# EAGLE design tester (EAGLE 9.6.2)

## Sheet 1 of 4: BUS
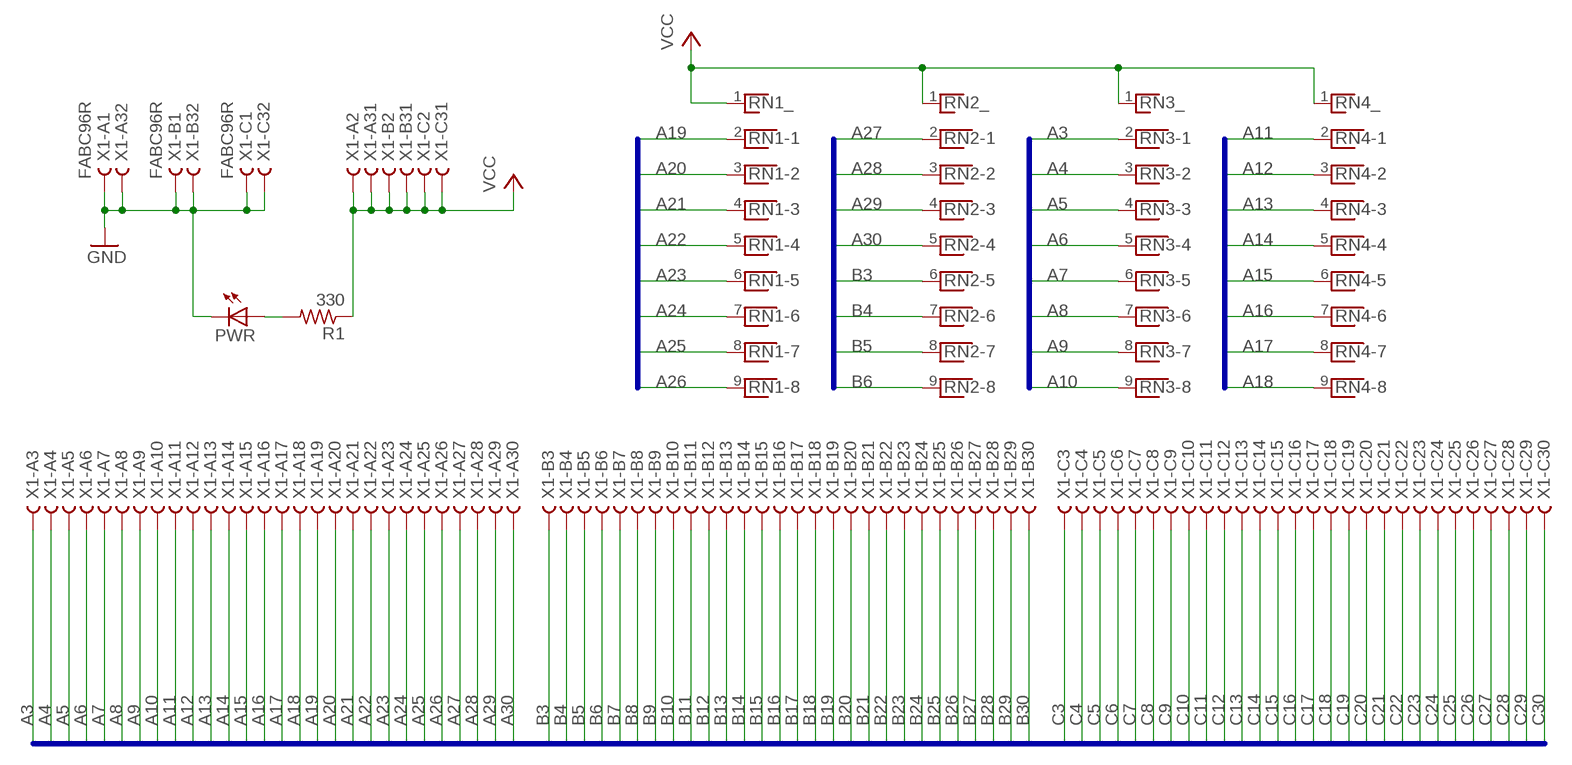
[diagram p0: schematic, sheet 1]

### Parts
PWR  LED5MM  [LED5MM]
R1  330  R-US_0207/10  [0207/10]
RN1  RNX8  [RN-9]
RN2  RNX8  [RN-9]
RN3  RNX8  [RN-9]
RN4  RNX8  [RN-9]
X1  FABC96R  [FABC96R]

### Nets
A3: RN3.2 X1.A3 ; also sheet 2
A4: RN3.3 X1.A4 ; also sheet 2
A5: RN3.4 X1.A5 ; also sheet 2
A6: RN3.5 X1.A6 ; also sheet 2
A7: RN3.6 X1.A7 ; also sheet 2
A8: RN3.7 X1.A8 ; also sheet 2
A9: RN3.8 X1.A9 ; also sheet 2
A10: RN3.9 X1.A10 ; also sheet 2
A11: RN4.2 X1.A11 ; also sheet 2
A12: RN4.3 X1.A12 ; also sheet 2
A13: RN4.4 X1.A13 ; also sheet 2
A14: RN4.5 X1.A14 ; also sheet 2
A15: RN4.6 X1.A15 ; also sheet 2
A16: RN4.7 X1.A16 ; also sheet 2
A17: RN4.8 X1.A17 ; also sheet 2
A18: RN4.9 X1.A18 ; also sheet 2
A19: RN1.2 X1.A19 ; also sheet 2
A20: RN1.3 X1.A20 ; also sheet 2
A21: RN1.4 X1.A21 ; also sheet 2
A22: RN1.5 X1.A22 ; also sheet 2
A23: RN1.6 X1.A23 ; also sheet 2
A24: RN1.7 X1.A24 ; also sheet 2
A25: RN1.8 X1.A25 ; also sheet 2
A26: RN1.9 X1.A26 ; also sheet 2
A27: RN2.2 X1.A27 ; also sheet 2
A28: RN2.3 X1.A28 ; also sheet 2
A29: RN2.4 X1.A29 ; also sheet 2
A30: RN2.5 X1.A30 ; also sheet 2
B3: RN2.6 X1.B3 ; also sheet 2
B4: RN2.7 X1.B4 ; also sheet 2
B5: RN2.8 X1.B5 ; also sheet 2
B6: RN2.9 X1.B6 ; also sheet 2
B7: X1.B7 ; also sheet 2
B8: X1.B8 ; also sheet 2
B9: X1.B9 ; also sheet 2
B10: X1.B10 ; also sheet 2
B11: X1.B11 ; also sheet 2
B12: X1.B12 ; also sheet 2
B13: X1.B13 ; also sheet 2
B14: X1.B14 ; also sheet 2
B15: X1.B15 ; also sheet 2
B16: X1.B16 ; also sheet 2
B17: X1.B17 ; also sheet 2
B18: X1.B18 ; also sheet 2
B19: X1.B19 ; also sheet 2
B20: X1.B20 ; also sheet 2
B21: X1.B21 ; also sheet 2
B22: X1.B22 ; also sheet 2
B23: X1.B23 ; also sheet 2
B24: X1.B24 ; also sheet 2
B25: X1.B25 ; also sheet 2
B26: X1.B26 ; also sheet 2
B27: X1.B27 ; also sheet 2
B28: X1.B28 ; also sheet 2
B29: X1.B29 ; also sheet 2
B30: X1.B30 ; also sheet 2
C3: X1.C3 ; also sheet 2
C4: X1.C4 ; also sheet 2
C5: X1.C5 ; also sheet 2
C6: X1.C6 ; also sheet 2
C7: X1.C7 ; also sheet 2
C8: X1.C8 ; also sheet 2
C9: X1.C9 ; also sheet 2
C10: X1.C10 ; also sheet 2
C11: X1.C11 ; also sheet 2
C12: X1.C12 ; also sheet 2
C13: X1.C13 ; also sheet 2
C14: X1.C14 ; also sheet 2
C15: X1.C15 ; also sheet 2
C16: X1.C16 ; also sheet 2
C17: X1.C17 ; also sheet 2
C18: X1.C18 ; also sheet 2
C19: X1.C19 ; also sheet 2
C20: X1.C20 ; also sheet 2
C21: X1.C21 ; also sheet 2
C22: X1.C22 ; also sheet 2
C23: X1.C23 ; also sheet 2
C24: X1.C24 ; also sheet 2
C25: X1.C25 ; also sheet 2
C26: X1.C26 ; also sheet 2
C27: X1.C27 ; also sheet 2
C28: X1.C28 ; also sheet 2
C29: X1.C29 ; also sheet 2
C30: X1.C30 ; also sheet 2
GND: PWR.K(C) X1.A1 X1.A32 X1.B1 X1.B32 X1.C1 X1.C32 ; also sheet 2,3,4
N$5: PWR.A R1.2
VCC: R1.1 RN1.1 RN2.1 RN3.1 RN4.1 X1.A2 X1.A31 X1.B2 X1.B31 X1.C2 X1.C31 ; also sheet 2,3,4

### Buses
ADDR[0..15],DATA[0..15],CNTL[0..48]
ADDR[0..15],DATA[0..15],REG-FUNC,REG-BRD-RD-ID,REG-RD-ID[0..2],REG-BRD-LD-ID,REG-LD-ID[0..2],REG-RD-LO,REG-LD-LO,REG-RD-HI,REG-LD-HI,MEM-WR,MEM-RD,I/O-WR,I/O-RD,I/O-ADDR,INT,INTA,I/D-REG-LD,I/D-REG-RD,I/D-REG-DN,I/D-REG-UP,SP/PC-SEL,SP/PC-DATA-RD-LO,SP/PC-DATA-RD-HI,SP/PC-ADDR-RD,SP/PC-LD-LO,SP/PC-LD-HI,SP/PC-DN,SP/PC-UP,ALU-FUNC,ALU[0..3],AC-LD-INV,AC-LD,AC-RD,SR-LD,BR-COND,H/L-SWAP,IN,OUT,UNUSED[1..5],RUN,RESET

## Sheet 2 of 4: bus cntl
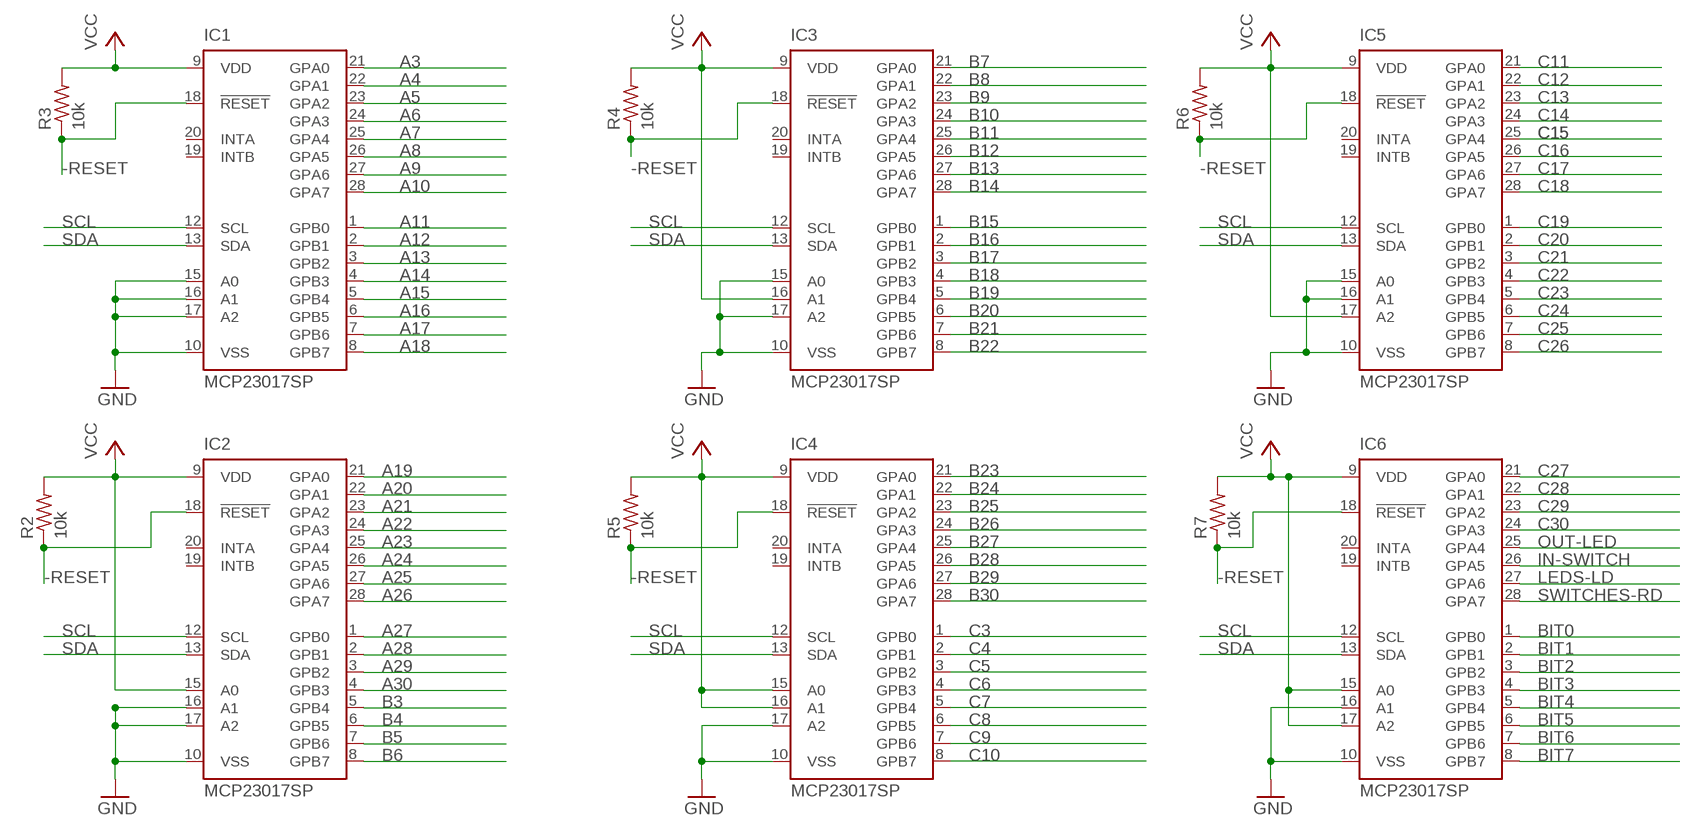
[diagram p1: schematic, sheet 2]

### Parts
IC1  MCP23017SP  [DIL28-3]
IC2  MCP23017SP  [DIL28-3]
IC3  MCP23017SP  [DIL28-3]
IC4  MCP23017SP  [DIL28-3]
IC5  MCP23017SP  [DIL28-3]
IC6  MCP23017SP  [DIL28-3]
R2  10k  R-US_0207/10  [0207/10]
R3  10k  R-US_0207/10  [0207/10]
R4  10k  R-US_0207/10  [0207/10]
R5  10k  R-US_0207/10  [0207/10]
R6  10k  R-US_0207/10  [0207/10]
R7  10k  R-US_0207/10  [0207/10]

### Nets
-RESET: IC1.18(!RESET) IC2.18(!RESET) IC3.18(!RESET) IC4.18(!RESET) IC5.18(!RESET) IC6.18(!RESET) R2.1 R3.1 R4.1 R5.1 R6.1 R7.1 ; also sheet 3
A3: IC1.21(GPA0) ; also sheet 1
A4: IC1.22(GPA1) ; also sheet 1
A5: IC1.23(GPA2) ; also sheet 1
A6: IC1.24(GPA3) ; also sheet 1
A7: IC1.25(GPA4) ; also sheet 1
A8: IC1.26(GPA5) ; also sheet 1
A9: IC1.27(GPA6) ; also sheet 1
A10: IC1.28(GPA7) ; also sheet 1
A11: IC1.1(GPB0) ; also sheet 1
A12: IC1.2(GPB1) ; also sheet 1
A13: IC1.3(GPB2) ; also sheet 1
A14: IC1.4(GPB3) ; also sheet 1
A15: IC1.5(GPB4) ; also sheet 1
A16: IC1.6(GPB5) ; also sheet 1
A17: IC1.7(GPB6) ; also sheet 1
A18: IC1.8(GPB7) ; also sheet 1
A19: IC2.21(GPA0) ; also sheet 1
A20: IC2.22(GPA1) ; also sheet 1
A21: IC2.23(GPA2) ; also sheet 1
A22: IC2.24(GPA3) ; also sheet 1
A23: IC2.25(GPA4) ; also sheet 1
A24: IC2.26(GPA5) ; also sheet 1
A25: IC2.27(GPA6) ; also sheet 1
A26: IC2.28(GPA7) ; also sheet 1
A27: IC2.1(GPB0) ; also sheet 1
A28: IC2.2(GPB1) ; also sheet 1
A29: IC2.3(GPB2) ; also sheet 1
A30: IC2.4(GPB3) ; also sheet 1
B3: IC2.5(GPB4) ; also sheet 1
B4: IC2.6(GPB5) ; also sheet 1
B5: IC2.7(GPB6) ; also sheet 1
B6: IC2.8(GPB7) ; also sheet 1
B7: IC3.21(GPA0) ; also sheet 1
B8: IC3.22(GPA1) ; also sheet 1
B9: IC3.23(GPA2) ; also sheet 1
B10: IC3.24(GPA3) ; also sheet 1
B11: IC3.25(GPA4) ; also sheet 1
B12: IC3.26(GPA5) ; also sheet 1
B13: IC3.27(GPA6) ; also sheet 1
B14: IC3.28(GPA7) ; also sheet 1
B15: IC3.1(GPB0) ; also sheet 1
B16: IC3.2(GPB1) ; also sheet 1
B17: IC3.3(GPB2) ; also sheet 1
B18: IC3.4(GPB3) ; also sheet 1
B19: IC3.5(GPB4) ; also sheet 1
B20: IC3.6(GPB5) ; also sheet 1
B21: IC3.7(GPB6) ; also sheet 1
B22: IC3.8(GPB7) ; also sheet 1
B23: IC4.21(GPA0) ; also sheet 1
B24: IC4.22(GPA1) ; also sheet 1
B25: IC4.23(GPA2) ; also sheet 1
B26: IC4.24(GPA3) ; also sheet 1
B27: IC4.25(GPA4) ; also sheet 1
B28: IC4.26(GPA5) ; also sheet 1
B29: IC4.27(GPA6) ; also sheet 1
B30: IC4.28(GPA7) ; also sheet 1
BIT0: IC6.1(GPB0) ; also sheet 4
BIT1: IC6.2(GPB1) ; also sheet 4
BIT2: IC6.3(GPB2) ; also sheet 4
BIT3: IC6.4(GPB3) ; also sheet 4
BIT4: IC6.5(GPB4) ; also sheet 4
BIT5: IC6.6(GPB5) ; also sheet 4
BIT6: IC6.7(GPB6) ; also sheet 4
BIT7: IC6.8(GPB7) ; also sheet 4
C3: IC4.1(GPB0) ; also sheet 1
C4: IC4.2(GPB1) ; also sheet 1
C5: IC4.3(GPB2) ; also sheet 1
C6: IC4.4(GPB3) ; also sheet 1
C7: IC4.5(GPB4) ; also sheet 1
C8: IC4.6(GPB5) ; also sheet 1
C9: IC4.7(GPB6) ; also sheet 1
C10: IC4.8(GPB7) ; also sheet 1
C11: IC5.21(GPA0) ; also sheet 1
C12: IC5.22(GPA1) ; also sheet 1
C13: IC5.23(GPA2) ; also sheet 1
C14: IC5.24(GPA3) ; also sheet 1
C15: IC5.25(GPA4) ; also sheet 1
C16: IC5.26(GPA5) ; also sheet 1
C17: IC5.27(GPA6) ; also sheet 1
C18: IC5.28(GPA7) ; also sheet 1
C19: IC5.1(GPB0) ; also sheet 1
C20: IC5.2(GPB1) ; also sheet 1
C21: IC5.3(GPB2) ; also sheet 1
C22: IC5.4(GPB3) ; also sheet 1
C23: IC5.5(GPB4) ; also sheet 1
C24: IC5.6(GPB5) ; also sheet 1
C25: IC5.7(GPB6) ; also sheet 1
C26: IC5.8(GPB7) ; also sheet 1
C27: IC6.21(GPA0) ; also sheet 1
C28: IC6.22(GPA1) ; also sheet 1
C29: IC6.23(GPA2) ; also sheet 1
C30: IC6.24(GPA3) ; also sheet 1
GND: IC1.10(VSS) IC1.15(A0) IC1.16(A1) IC1.17(A2) IC2.10(VSS) IC2.16(A1) IC2.17(A2) IC3.10(VSS) IC3.15(A0) IC3.17(A2) IC4.10(VSS) IC4.17(A2) IC5.10(VSS) IC5.15(A0) IC5.16(A1) IC6.10(VSS) IC6.16(A1) ; also sheet 1,3,4
IN-SWITCH: IC6.26(GPA5) ; also sheet 4
LEDS-LD: IC6.27(GPA6) ; also sheet 4
OUT-LED: IC6.25(GPA4) ; also sheet 4
SCL: IC1.12(SCL) IC2.12(SCL) IC3.12(SCL) IC4.12(SCL) IC5.12(SCL) IC6.12(SCL) ; also sheet 3
SDA: IC1.13(SDA) IC2.13(SDA) IC3.13(SDA) IC4.13(SDA) IC5.13(SDA) IC6.13(SDA) ; also sheet 3
SWITCHES-RD: IC6.28(GPA7) ; also sheet 4
VCC: IC1.9(VDD) IC2.9(VDD) IC2.15(A0) IC3.9(VDD) IC3.16(A1) IC4.9(VDD) IC4.15(A0) IC4.16(A1) IC5.9(VDD) IC5.17(A2) IC6.9(VDD) IC6.15(A0) IC6.17(A2) R2.2 R3.2 R4.2 R5.2 R6.2 R7.2 ; also sheet 1,3,4
Unconnected: IC1.19(INTB) IC1.20(INTA) IC2.19(INTB) IC2.20(INTA) IC3.19(INTB) IC3.20(INTA) IC4.19(INTB) IC4.20(INTA) IC5.19(INTB) IC5.20(INTA) IC6.19(INTB) IC6.20(INTA)

## Sheet 3 of 4: CPU
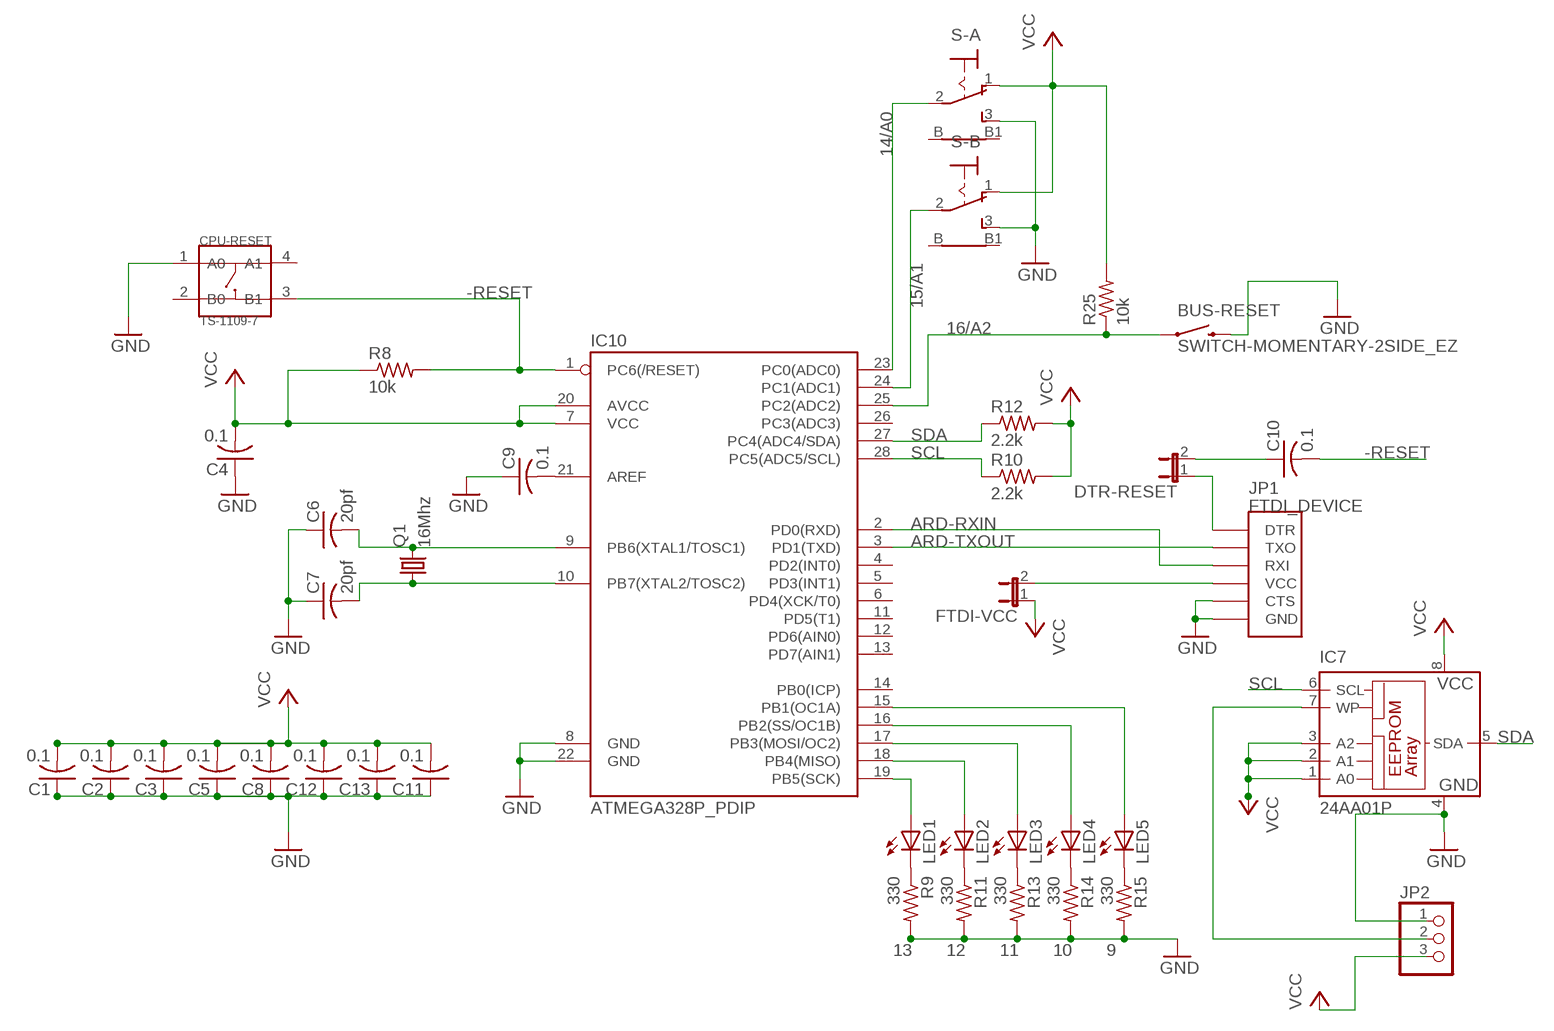
[diagram p2: schematic, sheet 3]

### Parts
BUS-RESET  SWITCH-MOMENTARY-2SIDE_EZ  [TACTILE-PTH-SIDEEZ]
C1  0.1  C-US025-024X044  [C025-024X044]
C2  0.1  C-US025-024X044  [C025-024X044]
C3  0.1  C-US025-024X044  [C025-024X044]
C4  0.1  C-US025-024X044  [C025-024X044]
C5  0.1  C-US025-024X044  [C025-024X044]
C6  20pf  C-US025-024X044  [C025-024X044]
C7  20pf  C-US025-024X044  [C025-024X044]
C8  0.1  C-US025-024X044  [C025-024X044]
C9  0.1  C-US025-024X044  [C025-024X044]
C10  0.1  C-US025-024X044  [C025-024X044]
C11  0.1  C-US025-024X044  [C025-024X044]
C12  0.1  C-US025-024X044  [C025-024X044]
C13  0.1  C-US025-024X044  [C025-024X044]
CPU-RESET  TS-1109-7  DIP-BUTTON-TOP-BLACK(4P-D6.2MM)  [SW4-6.2X6.2X5.0MM]
DTR-RESET  JP1E  [JP1]
FTDI-VCC  JP1E  [JP1]
IC7  24AA01P  [DIL8]
IC10  ATMEGA328P_PDIP  [DIL28-3]
JP1  FTDI_DEVICE  [FTDI_DEVICE_SIDE]
JP2  PINHD-1X3  [1X03]
LED1  LED5MM  [LED5MM]
LED2  LED5MM  [LED5MM]
LED3  LED5MM  [LED5MM]
LED4  LED5MM  [LED5MM]
LED5  LED5MM  [LED5MM]
Q1  16Mhz  CRYSTALHC49S  [HC49/S]
R8  10k  R-US_0207/10  [0207/10]
R9  330  R-US_0207/10  [0207/10]
R10  2.2k  R-US_0207/10  [0207/10]
R11  330  R-US_0207/10  [0207/10]
R12  2.2k  R-US_0207/10  [0207/10]
R13  330  R-US_0207/10  [0207/10]
R14  330  R-US_0207/10  [0207/10]
R15  330  R-US_0207/10  [0207/10]
R25  10k  R-US_0207/10  [0207/10]
S-A  9070-1W  [9070-1W]
S-B  9070-1W  [9070-1W]

### Nets
-RESET: C10.2 CPU-RESET.3(B1) IC10.1(PC6(/RESET)) R8.2 ; also sheet 2
ARD-RXIN: IC10.2(PD0(RXD)) JP1.P$3(RXI)
ARD-TXOUT: IC10.3(PD1(TXD)) JP1.P$2(TXO)
GND: BUS-RESET.2 C1.1 C2.1 C3.1 C4.1 C5.1 C6.1 C7.1 C8.1 C9.1 C11.1 C12.1 C13.1 CPU-RESET.1(A0) IC7.4(GND) IC10.8(GND) IC10.22(GND) JP1.P$5(CTS) JP1.P$6(GND) JP2.1 R9.2 R11.2 R13.2 R14.2 R15.2 S-A.3(S) S-B.3(S) ; also sheet 1,2,4
N$1: IC10.19(PB5(SCK)) LED1.A
N$2: IC7.7(WP) JP2.2
N$3: C6.2 IC10.9(PB6(XTAL1/TOSC1)) Q1.2
N$4: C7.2 IC10.10(PB7(XTAL2/TOSC2)) Q1.1
N$6: IC10.18(PB4(MISO)) LED2.A
N$7: IC10.17(PB3(MOSI/OC2)) LED3.A
N$8: IC10.16(PB2(SS/OC1B)) LED4.A
N$9: C10.1 DTR-RESET.2
N$10: IC10.15(PB1(OC1A)) LED5.A
N$11: LED2.K(C) R11.1
N$12: LED1.K(C) R9.1
N$13: LED3.K(C) R13.1
N$14: C9.2 IC10.21(AREF)
N$15: LED4.K(C) R14.1
N$16: LED5.K(C) R15.1
N$18: IC10.23(PC0(ADC0)) S-A.2(P)
N$19: IC10.24(PC1(ADC1)) S-B.2(P)
N$28: DTR-RESET.1 JP1.P$1(DTR)
N$29: FTDI-VCC.2 JP1.P$4(VCC)
N$39: BUS-RESET.1 IC10.25(PC2(ADC2)) R25.1
SCL: IC7.6(SCL) IC10.28(PC5(ADC5/SCL)) R10.1 ; also sheet 2
SDA: IC7.5(SDA) IC10.27(PC4(ADC4/SDA)) R12.1 ; also sheet 2
VCC: C1.2 C2.2 C3.2 C4.2 C5.2 C8.2 C11.2 C12.2 C13.2 FTDI-VCC.1 IC7.1(A0) IC7.2(A1) IC7.3(A2) IC7.8(VCC) IC10.7(VCC) IC10.20(AVCC) JP2.3 R8.1 R10.2 R12.2 R25.2 S-A.1(O) S-B.1(O) ; also sheet 1,2,4
Unconnected: CPU-RESET.2(B0) CPU-RESET.4(A1) IC10.4(PD2(INT0)) IC10.5(PD3(INT1)) IC10.6(PD4(XCK/T0)) IC10.11(PD5(T1)) IC10.12(PD6(AIN0)) IC10.13(PD7(AIN1)) IC10.14(PB0(ICP)) IC10.26(PC3(ADC3)) S-A.B S-A.B1 S-B.B S-B.B1

### Notes on the sheet
- 14/A0
- 15/A1
- 16/A2
- 13 | 12 | 11 | 10 | 9

## Sheet 4 of 4: I/O
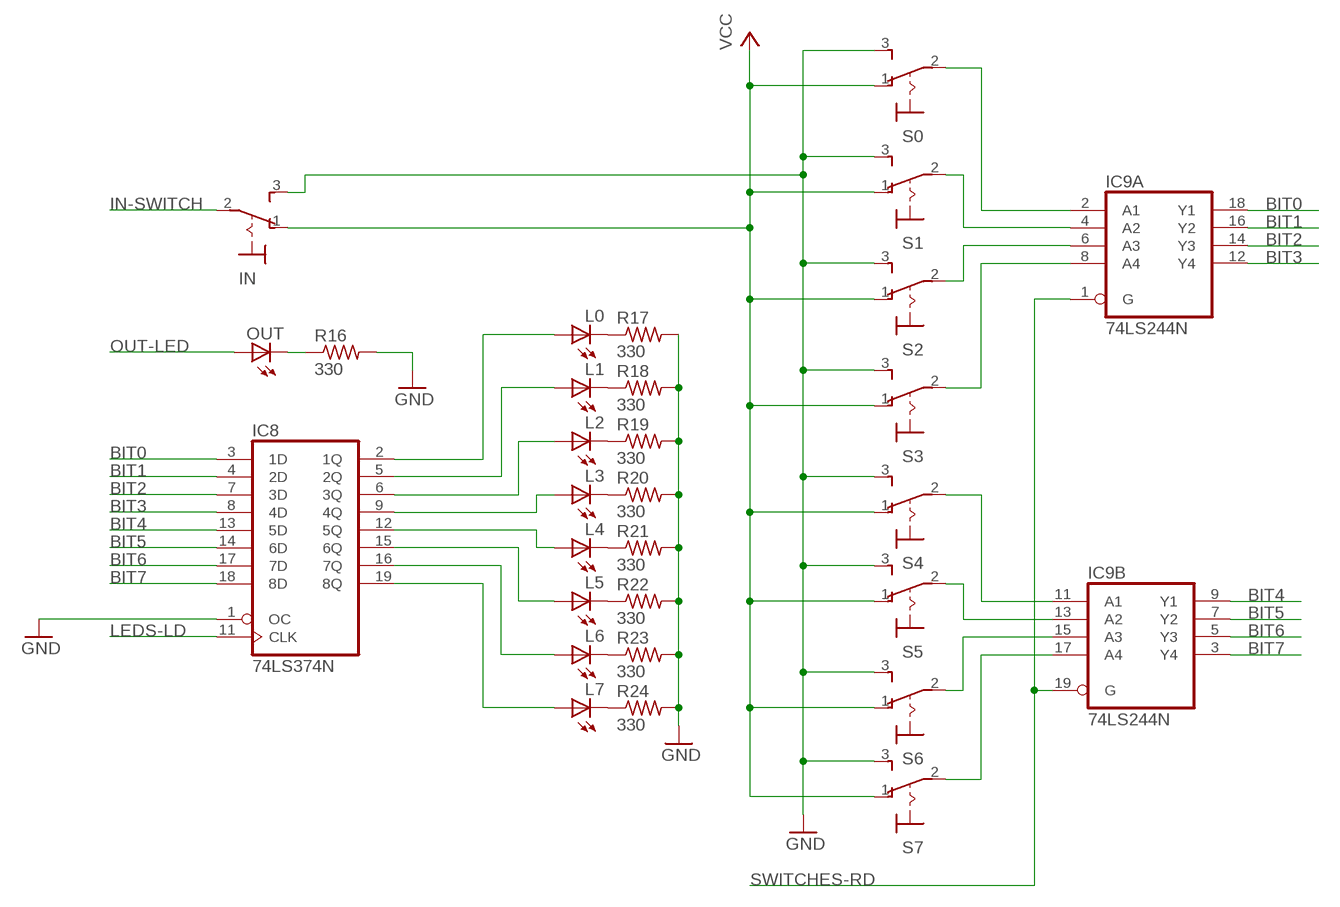
[diagram p3: schematic, sheet 4]

### Parts
IC8  74LS374N  [DIL20]
IC9  74LS244N  [DIL20]
IN  M9040P  [M9040P]
L0  LED5MM  [LED5MM]
L1  LED5MM  [LED5MM]
L2  LED5MM  [LED5MM]
L3  LED5MM  [LED5MM]
L4  LED5MM  [LED5MM]
L5  LED5MM  [LED5MM]
L6  LED5MM  [LED5MM]
L7  LED5MM  [LED5MM]
OUT  LED5MM  [LED5MM]
R16  330  R-US_0207/10  [0207/10]
R17  330  R-US_0207/10  [0207/10]
R18  330  R-US_0207/10  [0207/10]
R19  330  R-US_0207/10  [0207/10]
R20  330  R-US_0207/10  [0207/10]
R21  330  R-US_0207/10  [0207/10]
R22  330  R-US_0207/10  [0207/10]
R23  330  R-US_0207/10  [0207/10]
R24  330  R-US_0207/10  [0207/10]
S0  M9040P  [M9040P]
S1  M9040P  [M9040P]
S2  M9040P  [M9040P]
S3  M9040P  [M9040P]
S4  M9040P  [M9040P]
S5  M9040P  [M9040P]
S6  M9040P  [M9040P]
S7  M9040P  [M9040P]

### Nets
BIT0: IC8.3(1D) IC9.18(A:Y1) ; also sheet 2
BIT1: IC8.4(2D) IC9.16(A:Y2) ; also sheet 2
BIT2: IC8.7(3D) IC9.14(A:Y3) ; also sheet 2
BIT3: IC8.8(4D) IC9.12(A:Y4) ; also sheet 2
BIT4: IC8.13(5D) IC9.9(B:Y1) ; also sheet 2
BIT5: IC8.14(6D) IC9.7(B:Y2) ; also sheet 2
BIT6: IC8.17(7D) IC9.5(B:Y3) ; also sheet 2
BIT7: IC8.18(8D) IC9.3(B:Y4) ; also sheet 2
GND: IC8.1(OC) IN.3(S) R16.2 R17.2 R18.2 R19.2 R20.2 R21.2 R22.2 R23.2 R24.2 S0.3(S) S1.3(S) S2.3(S) S3.3(S) S4.3(S) S5.3(S) S6.3(S) S7.3(S) ; also sheet 1,2,3
IN-SWITCH: IN.2(P) ; also sheet 2
LEDS-LD: IC8.11(CLK) ; also sheet 2
N$17: L7.K(C) R24.1
N$20: L6.K(C) R23.1
N$21: L5.K(C) R22.1
N$22: L4.K(C) R21.1
N$23: L3.K(C) R20.1
N$24: L2.K(C) R19.1
N$25: L1.K(C) R18.1
N$26: L0.K(C) R17.1
N$27: OUT.K(C) R16.1
N$31: IC8.5(2Q) L1.A
N$32: IC8.9(4Q) L3.A
N$33: IC8.12(5Q) L4.A
N$34: IC8.15(6Q) L5.A
N$35: IC8.6(3Q) L2.A
N$36: IC8.16(7Q) L6.A
N$37: IC8.19(8Q) L7.A
N$38: IC8.2(1Q) L0.A
N$40: IC9.2(A:A1) S0.2(P)
N$41: IC9.8(A:A4) S3.2(P)
N$42: IC9.6(A:A3) S2.2(P)
N$43: IC9.4(A:A2) S1.2(P)
N$44: IC9.11(B:A1) S4.2(P)
N$45: IC9.17(B:A4) S7.2(P)
N$46: IC9.13(B:A2) S5.2(P)
N$47: IC9.15(B:A3) S6.2(P)
OUT-LED: OUT.A ; also sheet 2
SWITCHES-RD: IC9.1(A:G) IC9.19(B:G) ; also sheet 2
VCC: IN.1(O) S0.1(O) S1.1(O) S2.1(O) S3.1(O) S4.1(O) S5.1(O) S6.1(O) S7.1(O) ; also sheet 1,2,3

## Power pins joined to a net without a drawn wire
GND: IC8.10(GND) IC9.10(P:GND)
VCC: IC8.20(VCC) IC9.20(P:VCC)

## Library data of the parts
BUS-RESET = SparkFun-Electromechanical:SWITCH-MOMENTARY-2: Various NO switches- pushbuttons, reed, etc
C1-C13 = adafruit:C-US: CAPACITOR, American symbol
CPU-RESET = Seeed-OPL-Switch:DIP-BUTTON-TOP-BLACK(4P-D6.2MM): 311020032; MPN: TS-1109-7
DTR-RESET FTDI-VCC = jumper:JP1E: JUMPER
IC1-IC6 = microchip:MCP23017: http://ww1.microchip.com/downloads/en/DeviceDoc/21952a.pdf Source: http://ww1.microchip.com/downloads/en/DeviceDoc/21952a.pdf; MF: MICROCHIP; MPN: MCP23017-E/SP; OC_FARNELL: 1332088; OC_NEWARK: 31K2959
IC7 = microchip:24*: Serial EEPROM I2C; MPN: 24AA01-I/P; OC_FARNELL: 1331266; OC_NEWARK: 35M0692
IC8 = 74xx-us:74*374: Octal D type transparent LATCH, edge triggered
IC9 = 74xx-us:74*244: Octal BUFFER and LINE DRIVER, 3-state
IC10 = SparkFun-DigitalIC:ATMEGA328P_PDIP: uC used in the Arduino 32kb flash, 1k EEPROM, 2k SRAM This is the through-hole version of this chip.
IN S0 S1-S7 = switch:M9040P: TOGGLE SWITCH Marquardt
JP1 = SparkFun-Connectors:FTDI_DEVICE: Connector which mates to FTDI basic or FTDI cable.
JP2 = pinhead:PINHD-1X3: PIN HEADER
L0 L1-L7 LED1-LED5 OUT PWR = led:LED: LED OSRAM: - CHIPLED LG R971, LG N971, LY N971, LG Q971, LY Q971, LO R971, LY R971 LH N974, LH R974 LS Q976, LO Q976, LY Q976 LO Q996 - Hyper CHIPLED LW Q18S LB Q993, LB Q99A, LB R99A - SideLED LS A670, LO A670, LY A670, LG A670, LP A670 LB A673, LV A673, LT A673, LW A673 LH A674 LY A675 LS A676, LA A676, LO A676, LY A676, LW A676 LS A679, LY A679, LG A679 - Hyper Micro SIDELED® LS Y876, LA Y876, LO Y876, LY Y876 LT Y87S - SmartLED LW L88C, LW L88S LB L89C, LB L89S, LG L890 LS L89K, LO L89K, LY L89K LS L896, LA L896, LO L896, LY L896 - TOPLED LS T670, LO T670, LY T670, LG T670, LP T670 LSG T670, LSP T670, LSY T670, LOP T670, LYG T670 LG T671, LOG T671, LSG T671 LB T673, LV T673, LT T673, LW T673 LH T674 LS T676, LA T676, LO T676, LY T676, LB T676, LH T676, LSB T676, LW T676 LB T67C, LV T67C, LT T67C, LS T67K, LO T67K, LY T67K, LW E67C LS E67B, LA E67B, LO E67B, LY E67B, LB E67C, LV E67C, LT E67C LW T67C LS T679, LY T679, LG T679 LS T770, LO T770, LY T770, LG T770, LP T770 LB T773, LV T773, LT T773, LW T773 LH T774 LS E675, LA E675, LY E675, LS T675 LS T776, LA T776, LO T776, LY T776, LB T776 LHGB T686 LT T68C, LB T68C - Hyper Mini TOPLED® LB M676 - Mini TOPLED Santana® LG M470 LS M47K, LO M47K, LY M47K Source: http://www.osram.convergy.de LUXEON: - LUMILED® LXK2-PW12-R00, LXK2-PW12-S00, LXK2-PW14-U00, LXK2-PW14-V00 LXK2-PM12-R00, LXK2-PM12-S00, LXK2-PM14-U00 LXK2-PE12-Q00, LXK2-PE12-R00, LXK2-PE12-S00, LXK2-PE14-T00, LXK2-PE14-U00 LXK2-PB12-K00, LXK2-PB12-L00, LXK2-PB12-M00, LXK2-PB14-N00, LXK2-PB14-P00, LXK2-PB14-Q00 LXK2-PR12-L00, LXK2-PR12-M00, LXK2-PR14-Q00, LXK2-PR14-R00 LXK2-PD12-Q00, LXK2-PD12-R00, LXK2-PD12-S00 LXK2-PH12-R00, LXK2-PH12-S00 LXK2-PL12-P00, LXK2-PL12-Q00, LXK2-PL12-R00 Source: www.luxeon.com KINGBRIGHT: KA-3528ASYC Source: www.kingbright.com
Q1 = crystal:CRYSTAL: CRYSTAL; OC_FARNELL: 1667008; OC_NEWARK: unknown
R1-R7 = adafruit:R-US_: RESISTOR, American symbol
R8-R25 = resistor:R-US_: RESISTOR, American symbol
RN1-RN4 = resistor-net:RNX8: RESISTOR NETWORK; OC_FARNELL: unknown; OC_NEWARK: unknown
S-A S-B = switch:9070-1W: TOGGLE SWITCH Marquardt
X1 = con-vg:FABC96R: CONNECTOR female, 96 pins, type R, rows ABC, grid 2.54 mm

## Board
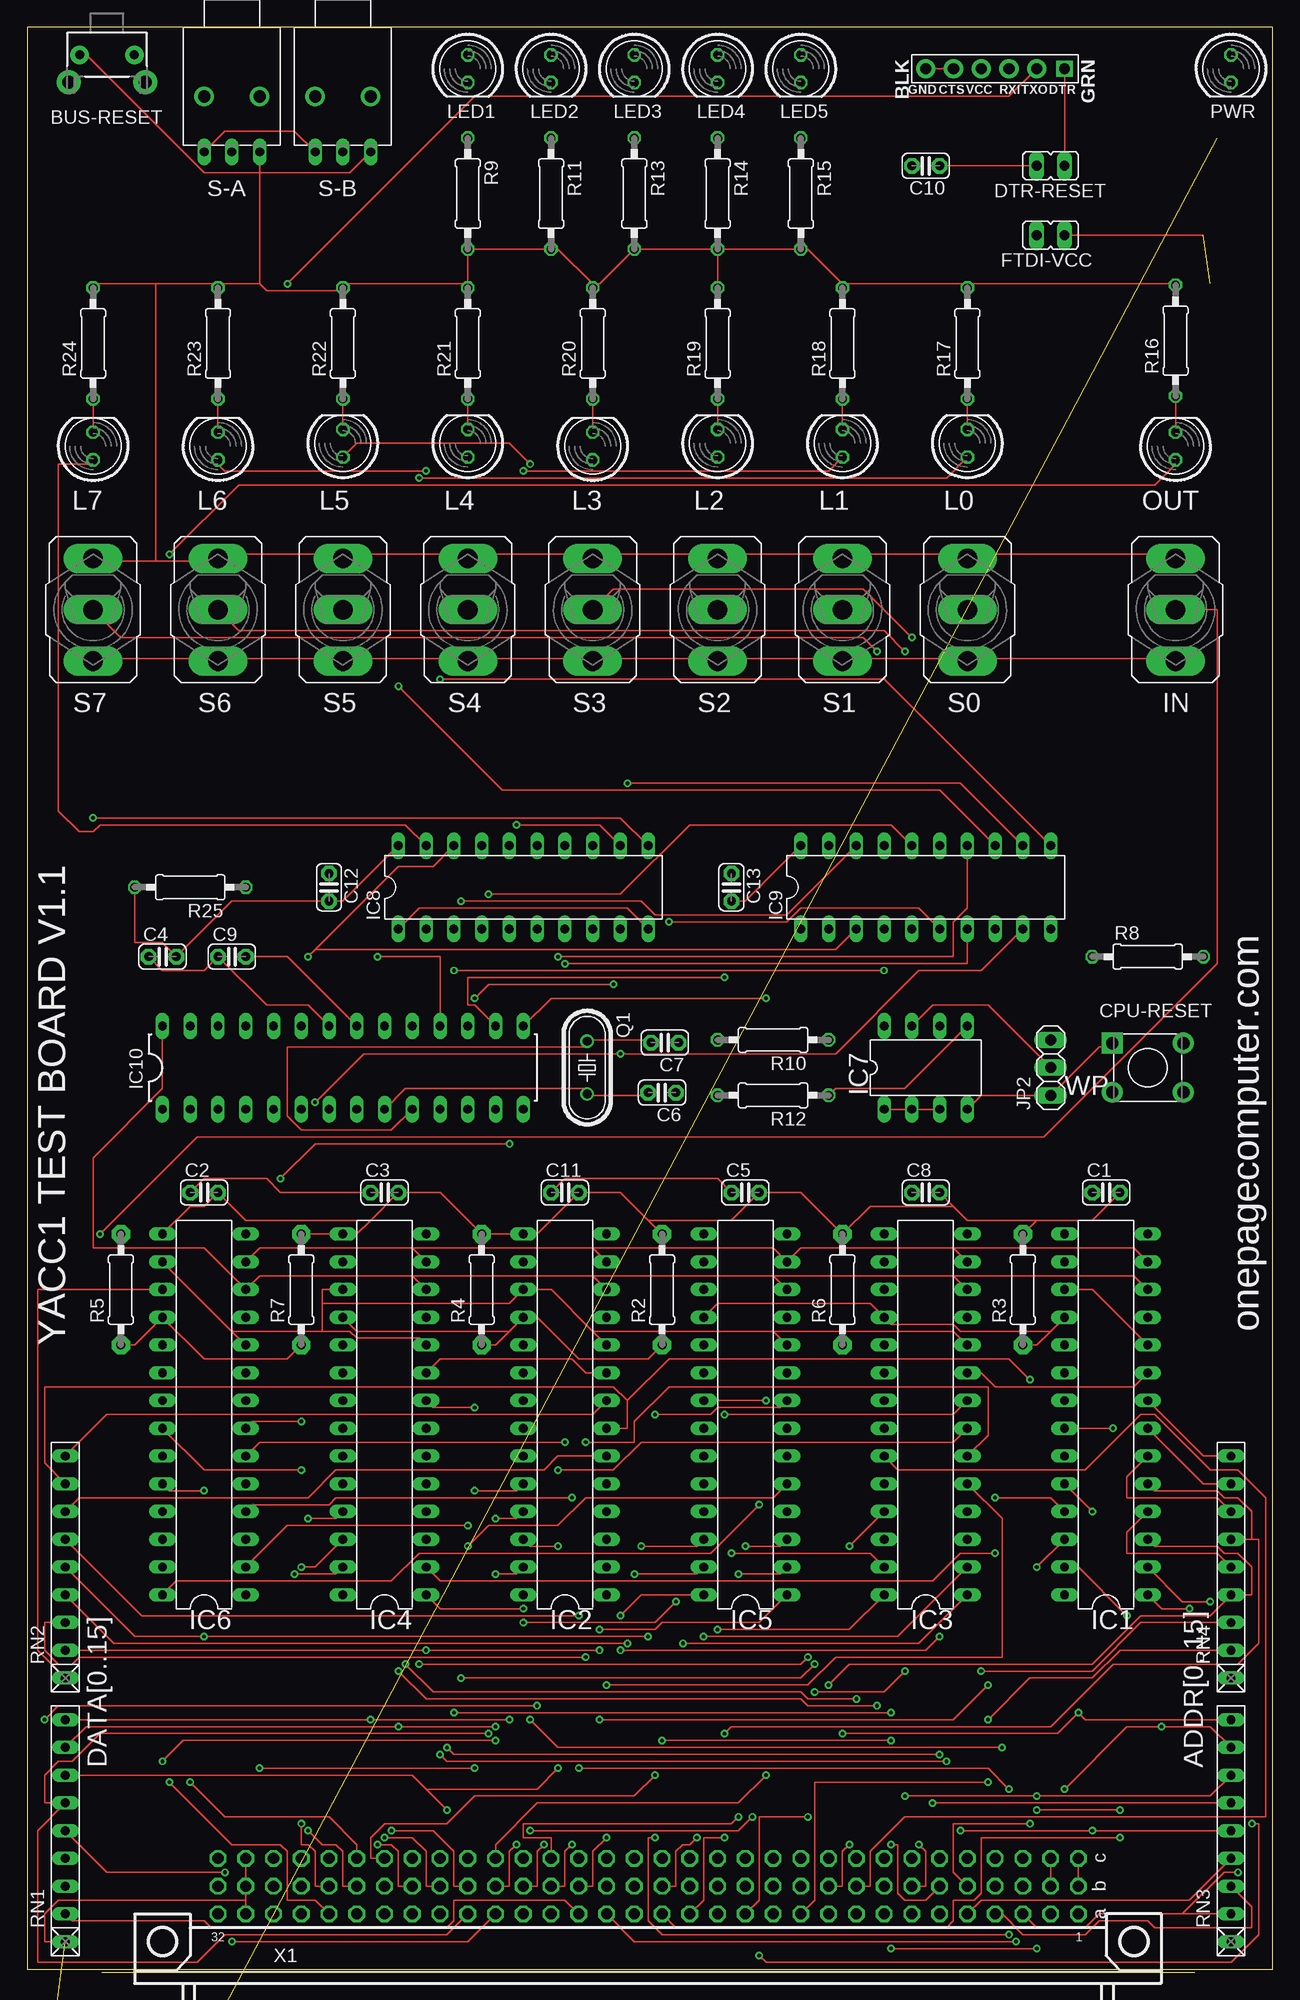
[diagram p4: board, top side]
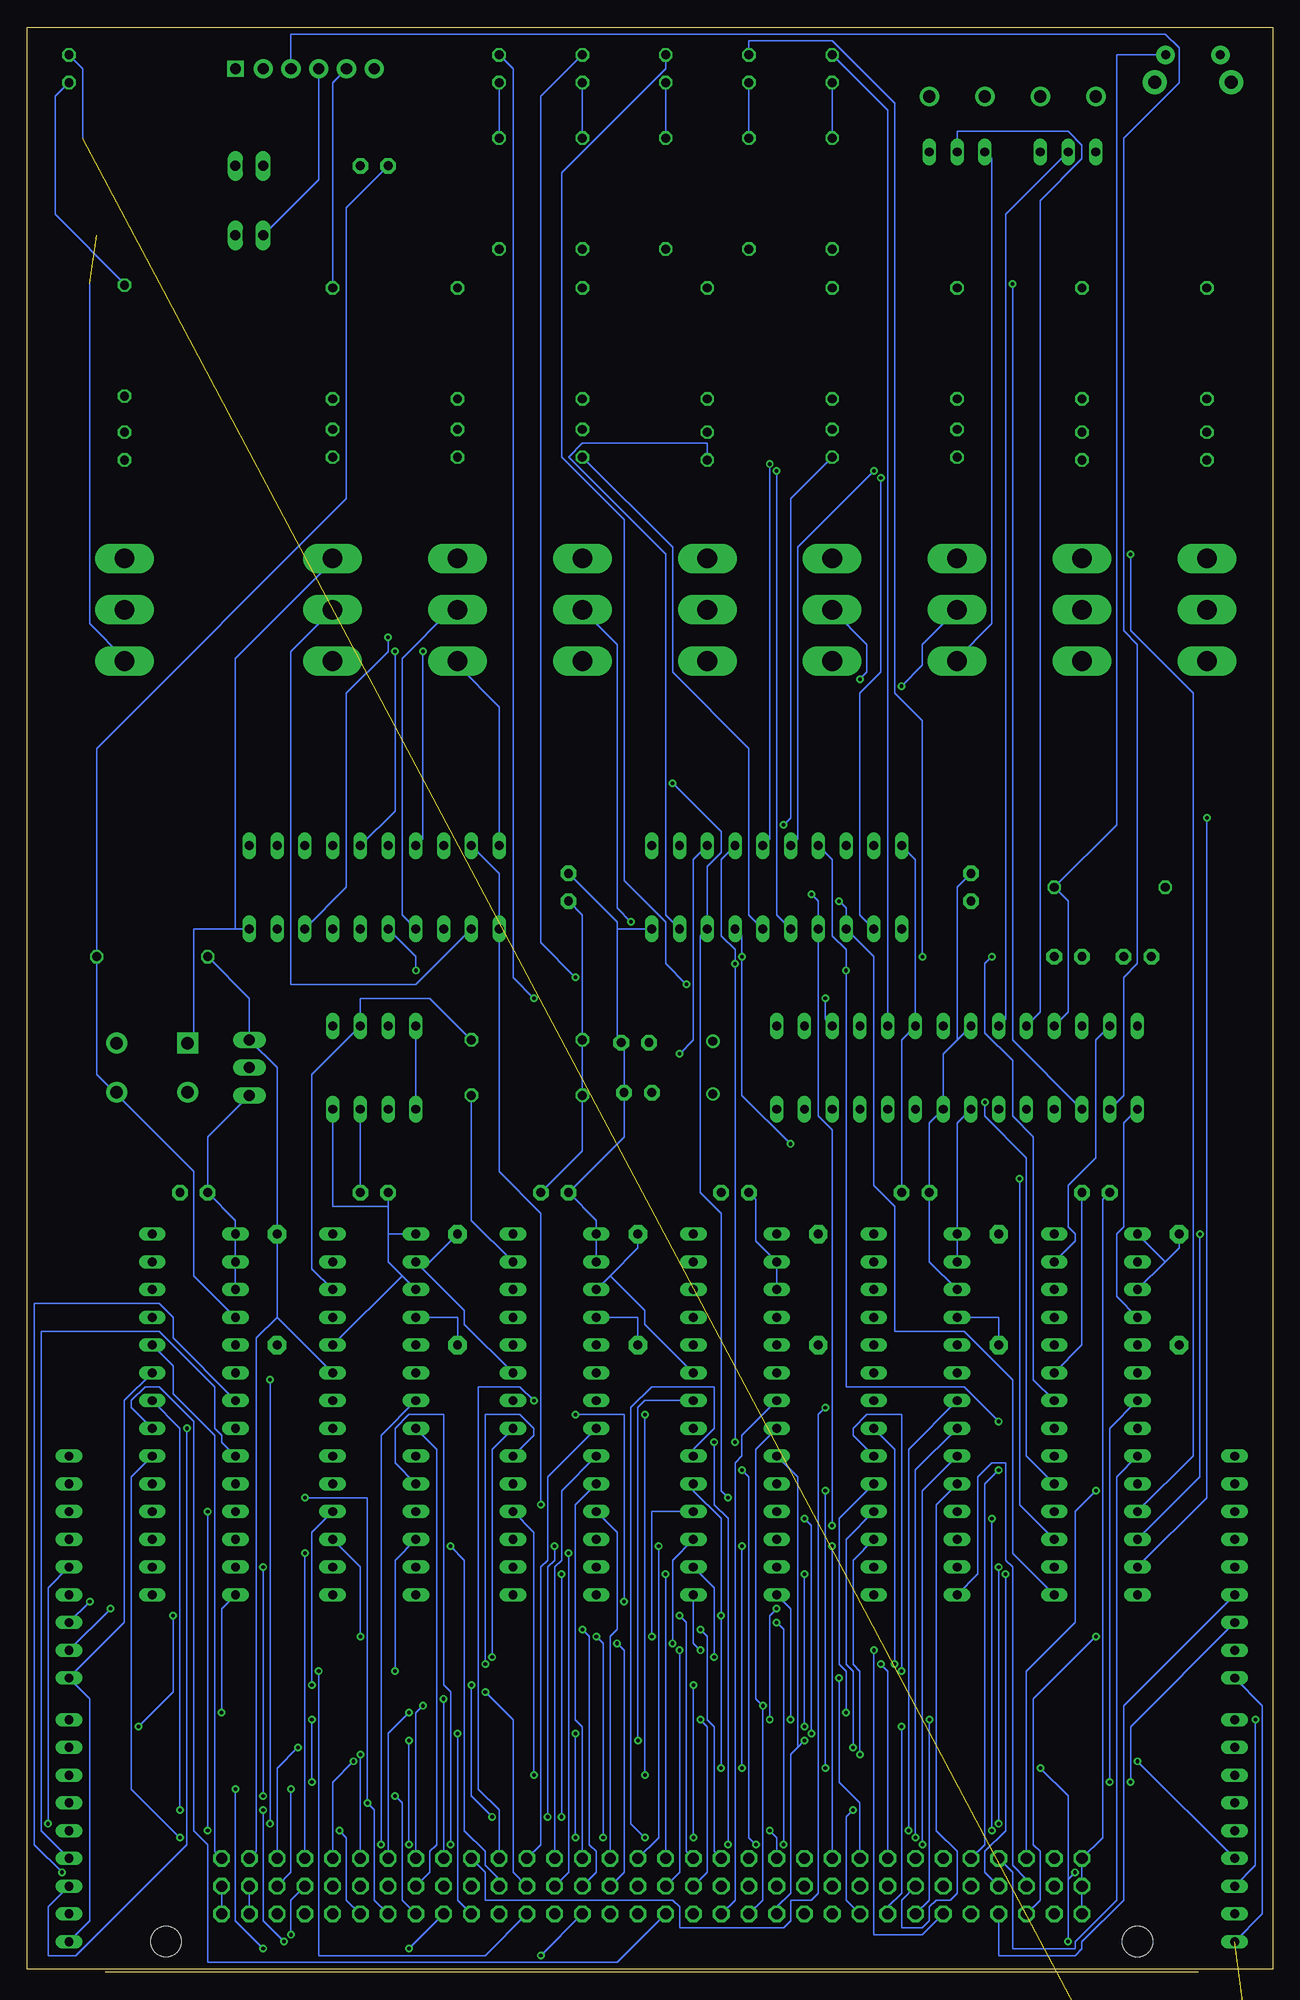
[diagram p5: board, bottom side, seen from below]

Size 113.97 x 177.78 mm. Coordinates in mm from the lower left corner, seen from the top.
Outline: 113.97,0 113.97,177.78 0,177.78 0,0 113.97,0
Copper layers (1*16): Top 0.0356mm / dielectric 1.5011mm / Bottom 0.0356mm
Design rules "LaenPCBOrder *": minimum track width 6mil, minimum drill 13mil, track to track 8mil, track to pad 8mil, pad to pad 8mil, via to via 8mil, smd to smd 6mil, copper to edge 15mil, drill to drill 6mil, minimum pad ring 7mil, minimum via ring 7mil, stop-mask expansion 3mil, vias tented up to drill 0mil, thermal gap 10mil

### Footprints (pad centres in the part's own frame; a part is rotated, then mirrored left to right if it is on the bottom)
TACTILE-PTH-SIDEEZ = drill 0.8 pad 1.7: 1 -2.5,0; 2 2.5,0 | drill 1.2 pad 2.2: ANCHOR1 -3.5,2.5; ANCHOR2 3.5,2.5
C025-024X044 = drill 0.813 pad 1.422 octagon: 1 -1.27,0; 2 1.27,0
SW4-6.2X6.2X5.0MM = drill 1.143 pad 1.905 square: 1 -3.25,2.25 | drill 1.143 pad 1.905: 2 -3.25,-2.25; 3 3.25,-2.25; 4 3.25,2.25
JP1 = drill 0.914 long: 1 0,-1.27; 2 0,1.27
DIL28-3 = drill 0.813 long: 1 -16.51,-3.81; 2 -13.97,-3.81; 3 -11.43,-3.81; 4 -8.89,-3.81; 5 -6.35,-3.81; 6 -3.81,-3.81; 7 -1.27,-3.81; 8 1.27,-3.81; 9 3.81,-3.81; 10 6.35,-3.81; 11 8.89,-3.81; 12 11.43,-3.81; 13 13.97,-3.81; 14 16.51,-3.81; 15 16.51,3.81; 16 13.97,3.81; 17 11.43,3.81; 18 8.89,3.81; 19 6.35,3.81; 20 3.81,3.81; 21 1.27,3.81; 22 -1.27,3.81; 23 -3.81,3.81; 24 -6.35,3.81; 25 -8.89,3.81; 26 -11.43,3.81; 27 -13.97,3.81; 28 -16.51,3.81
DIL8 = drill 0.813 long: 1 -3.81,-3.81; 2 -1.27,-3.81; 3 1.27,-3.81; 4 3.81,-3.81; 5 3.81,3.81; 6 1.27,3.81; 7 -1.27,3.81; 8 -3.81,3.81
DIL20 = drill 0.813 long: 1 -11.43,-3.81; 2 -8.89,-3.81; 3 -6.35,-3.81; 4 -3.81,-3.81; 5 -1.27,-3.81; 6 1.27,-3.81; 7 3.81,-3.81; 8 6.35,-3.81; 9 8.89,-3.81; 10 11.43,-3.81; 11 11.43,3.81; 12 8.89,3.81; 13 6.35,3.81; 14 3.81,3.81; 15 1.27,3.81; 16 -1.27,3.81; 17 -3.81,3.81; 18 -6.35,3.81; 19 -8.89,3.81; 20 -11.43,3.81
M9040P = drill 1.803 long: 1 0,4.699; 2 0,0; 3 0,-4.699
FTDI_DEVICE_SIDE = drill 1 square: P$1 -6.35,0 | drill 1.016 pad 1.778: P$2 -3.81,0; P$3 -1.27,0; P$4 1.27,0; P$5 3.81,0; P$6 6.35,0
1X03 = drill 1.016 long: 1 -2.54,0; 2 0,0; 3 2.54,0
LED5MM = drill 0.813 octagon: A -1.27,0; K 1.27,0
HC49/S = drill 0.813: 1 -2.413,0; 2 2.413,0
0207/10 = drill 0.813 pad 1.676 octagon: 1 -5.08,0; 2 5.08,0
0207/10' = drill 0.813 octagon: 1 -5.08,0; 2 5.08,0
RN-9 = drill 0.813 long: 1 -10.16,0; 2 -7.62,0; 3 -5.08,0; 4 -2.54,0; 5 0,0; 6 2.54,0; 7 5.08,0; 8 7.62,0; 9 10.16,0
9070-1W = drill 0.813 long: 1 5.08,-2.54; 2 5.08,0; 3 5.08,2.54 | drill 1.118 pad 1.778: B 0,-2.54; B1 0,2.54
FABC96R = drill 1.016 octagon: A1 -2.54,39.37; A2 -2.54,36.83; A3 -2.54,34.29; A4 -2.54,31.75; A5 -2.54,29.21; A6 -2.54,26.67; A7 -2.54,24.13; A8 -2.54,21.59; A9 -2.54,19.05; A10 -2.54,16.51; A11 -2.54,13.97; A12 -2.54,11.43; A13 -2.54,8.89; A14 -2.54,6.35; A15 -2.54,3.81; A16 -2.54,1.27; A17 -2.54,-1.27; A18 -2.54,-3.81; A19 -2.54,-6.35; A20 -2.54,-8.89; A21 -2.54,-11.43; A22 -2.54,-13.97; A23 -2.54,-16.51; A24 -2.54,-19.05; A25 -2.54,-21.59; A26 -2.54,-24.13; A27 -2.54,-26.67; A28 -2.54,-29.21; A29 -2.54,-31.75; A30 -2.54,-34.29; A31 -2.54,-36.83; A32 -2.54,-39.37; B1 -5.08,39.37; B2 -5.08,36.83; B3 -5.08,34.29; B4 -5.08,31.75; B5 -5.08,29.21; B6 -5.08,26.67; B7 -5.08,24.13; B8 -5.08,21.59; B9 -5.08,19.05; B10 -5.08,16.51; B11 -5.08,13.97; B12 -5.08,11.43; B13 -5.08,8.89; B14 -5.08,6.35; B15 -5.08,3.81; B16 -5.08,1.27; B17 -5.08,-1.27; B18 -5.08,-3.81; B19 -5.08,-6.35; B20 -5.08,-8.89; B21 -5.08,-11.43; B22 -5.08,-13.97; B23 -5.08,-16.51; B24 -5.08,-19.05; B25 -5.08,-21.59; B26 -5.08,-24.13; B27 -5.08,-26.67; B28 -5.08,-29.21; B29 -5.08,-31.75; B30 -5.08,-34.29; B31 -5.08,-36.83; B32 -5.08,-39.37; C1 -7.62,39.37; C2 -7.62,36.83; C3 -7.62,34.29; C4 -7.62,31.75; C5 -7.62,29.21; C6 -7.62,26.67; C7 -7.62,24.13; C8 -7.62,21.59; C9 -7.62,19.05; C10 -7.62,16.51; C11 -7.62,13.97; C12 -7.62,11.43; C13 -7.62,8.89; C14 -7.62,6.35; C15 -7.62,3.81; C16 -7.62,1.27; C17 -7.62,-1.27; C18 -7.62,-3.81; C19 -7.62,-6.35; C20 -7.62,-8.89; C21 -7.62,-11.43; C22 -7.62,-13.97; C23 -7.62,-16.51; C24 -7.62,-19.05; C25 -7.62,-21.59; C26 -7.62,-24.13; C27 -7.62,-26.67; C28 -7.62,-29.21; C29 -7.62,-31.75; C30 -7.62,-34.29; C31 -7.62,-36.83; C32 -7.62,-39.37 | hole 2.794: 0,-44.456; 0,44.456

### Placement (x,y rotation side)
BUS-RESET  7.29,175.26 180 top
C1  98.73,71.12 0 top
C2  16.18,71.12 0 top
C3  32.69,71.12 0 top
C4  12.37,92.71 0 top
C5  65.71,71.12 0 top
C6  58.09,80.26 180 top
C7  58.34,84.84 180 top
C8  82.22,71.12 0 top
C9  18.72,92.71 0 top
C10  82.22,165.1 180 top
C11  49.2,71.12 0 top
C12  27.61,99.06 270 top
C13  64.44,99.06 270 top
CPU-RESET  102.54,82.55 0 top
DTR-RESET  93.65,165.1 90 top
FTDI-VCC  93.65,158.75 90 top
IC1  98.73,50.8 90 top
IC2  49.2,50.8 90 top
IC3  82.22,50.8 90 top
IC4  32.69,50.8 90 top
IC5  65.71,50.8 90 top
IC6  16.18,50.8 90 top
IC7  82.22,82.55 0 top
IC8  45.39,99.06 0 top
IC9  82.22,99.06 0 top
IC10  28.88,82.55 0 top
IN  105.08,124.46 180 top
JP1  88.57,173.99 180 top
JP2  93.65,82.55 90 top
L0  86.03,139.7 90 top
L1  74.6,139.7 90 top
L2  63.17,139.7 90 top
L3  51.74,139.45 90 top
L4  40.31,139.7 90 top
L5  28.88,139.7 90 top
L6  17.45,139.45 90 top
L7  6.02,139.45 90 top
LED1  40.31,173.99 270 top
LED2  47.93,173.99 270 top
LED3  55.55,173.99 270 top
LED4  63.17,173.99 270 top
LED5  70.79,173.99 270 top
OUT  105.08,139.45 90 top
PWR  110.16,173.99 270 top
Q1  51.23,82.55 270 top
R1  6.02,-16.51 0 top  (outside the outline)
R2  58.09,62.23 90 top
R3  91.11,62.23 90 top
R4  41.58,62.23 90 top
R5  8.56,62.23 90 top
R6  74.6,62.23 90 top
R7  25.07,62.23 90 top
R8  10k  [0207/10']  102.54,92.71 0 top
R9  330  [0207/10']  40.31,162.56 270 top
R10  2.2k  [0207/10']  68.25,85.09 180 top
R11  330  [0207/10']  47.93,162.56 270 top
R12  2.2k  [0207/10']  68.25,80.01 180 top
R13  330  [0207/10']  55.55,162.56 270 top
R14  330  [0207/10']  63.17,162.56 270 top
R15  330  [0207/10']  70.79,162.56 270 top
R16  330  [0207/10']  105.08,149.1 90 top
R17  330  [0207/10']  86.03,148.84 90 top
R18  330  [0207/10']  74.6,148.84 90 top
R19  330  [0207/10']  63.17,148.84 90 top
R20  330  [0207/10']  51.74,148.84 90 top
R21  330  [0207/10']  40.31,148.84 90 top
R22  330  [0207/10']  28.88,148.84 90 top
R23  330  [0207/10']  17.45,148.84 90 top
R24  330  [0207/10']  6.02,148.84 90 top
R25  10k  [0207/10']  14.91,99.06 180 top
RN1  3.48,12.7 90 top
RN2  3.48,36.83 90 top
RN3  110.16,12.7 90 top
RN4  110.16,36.83 90 top
S0  86.03,124.46 180 top
S1  74.6,124.46 180 top
S2  63.17,124.46 180 top
S3  51.74,124.46 180 top
S4  40.31,124.46 180 top
S5  28.88,124.46 180 top
S6  17.45,124.46 180 top
S7  6.02,124.46 180 top
S-A  18.72,171.45 270 top
S-B  28.88,171.45 270 top
X1  56.82,2.54 270 top

### Tracks (layer width: path | path; a pad name or v marks a point on that pad's centre or on a via)
-RESET
  Top 0.152: R5.1 9.83,57.15 IC6.18 16.18,55.88 23.8,55.88 R7.1 | 93.65,58.42 92.38,57.15 R3.1 | 93.65,58.42 IC1.18 | 93.65,58.42 85.39,58.42 84.76,59.05 79.05,59.05 IC3.18 77.14,60.96 63.17,60.96 IC5.18 | 44.12,58.42 42.85,57.15 R4.1 | 44.12,58.42 IC2.18 46.66,59.69 50.47,55.88 56.82,55.88 R2.1 | IC4.18 30.15,58.42 44.12,58.42
  Bottom 0.152: IC10.1 13.64,77.47 13.64,67.94 14.27,67.31 14.27,61.59 IC6.18 | IC3.18 74.6,59.69 R6.1 | IC5.18 58.09,59.69 R2.1 | IC4.18 25.07,59.69 R7.1 | C10.2 84.76,161.29 84.76,134.62 107.62,111.76 R8.2 107.62,81.91 106.35,80.64 CPU-RESET.3 105.71,80.01 98.73,73.03 98.73,63.5 IC1.18
A3  (via drill 0.33)
  Top 0.152: 105.71,5.08 98.1,5.08 96.83,3.81 92.38,3.81 X1.A3 | 105.71,5.08 RN3.2 | v110.8,8.89 109.52,8.89 105.71,5.08
  Bottom 0.152: IC1.21 100.64,57.78 100.64,59.69 101.9,60.96 113.33,60.96 113.33,11.43 v110.8,8.89
A4  (via drill 0.33)
  Top 0.152: RN3.3 112.07,5.71 112.07,3.81 103.17,3.81 102.54,4.45 98.1,4.45 96.83,3.17 91.11,3.17 89.2,5.08 X1.A4 | v99.36,49.53 IC1.22
  Bottom 0.152: v99.36,49.53 99.36,11.43 109.52,1.27 112.07,1.27 112.07,5.71 RN3.3
A5
  Top 0.152: RN3.4 106.35,6.35 87.3,6.35 X1.A5
  Bottom 0.152: IC1.23 96.19,48.26 96.19,48.89 96.83,49.53 96.83,53.34 101.9,58.42 112.7,58.42 112.7,12.7 RN3.4
A6  (via drill 0.33)
  Top 0.152: v85.39,12.7 v97.46,12.7 RN3.5 | v97.46,41.91 IC1.24
  Bottom 0.152: v85.39,12.7 84.76,12.06 84.76,6.35 X1.A6 | v97.46,12.7 v97.46,41.91
A7  (via drill 0.33)
  Top 0.152: v82.86,15.24 RN3.6 | IC1.25 93.65,43.18 v88.57,43.18
  Bottom 0.152: X1.A7 82.22,6.35 82.22,14.6 v82.86,15.24 82.86,43.18 v88.57,43.18
A8  (via drill 0.33)
  Top 0.152: RN3.7 108.26,15.88 v92.38,15.88 v80.31,15.88 | v92.38,36.83 IC1.26
  Bottom 0.152: v80.31,15.88 79.68,15.24 79.68,6.35 X1.A8 | v92.38,15.88 v92.38,36.83
A9  (via drill 0.33)
  Top 0.152: RN3.8 108.26,22.23 v103.81,22.23 100.64,22.23 v94.92,16.51 | v100.64,32.38 96.19,36.83 IC1.27 | v92.38,1.9 v79.05,1.9
  Bottom 0.152: v103.81,22.23 100.64,25.4 v100.64,32.38 | v79.05,1.9 X1.A9 | v92.38,1.9 94.92,4.45 v94.92,16.51
A10  (via drill 0.33)
  Top 0.152: RN3.9 96.83,22.86 v96.19,23.49 94.29,21.59 v74.6,21.59
  Bottom 0.152: IC1.28 96.19,33.02 v96.19,23.49 | X1.A10 74.6,6.35 v74.6,21.59
A11  (via drill 0.33)
  Top 0.152: IC1.1 103.81,33.02 v106.35,33.02 | X1.A11 72.06,6.35 72.06,17.14 v87.94,17.14 | v87.94,22.86 91.75,26.67 97.46,26.67 100,29.21 RN4.2
  Bottom 0.152: RN4.2 v106.35,33.02 | v87.94,22.86 v87.94,17.14
A12  (via drill 0.33)
  Top 0.152: IC1.2 105.71,33.66 v108.26,33.66 | v87.3,27.3 97.46,27.3 101.9,31.75 RN4.3
  Bottom 0.152: RN4.3 v108.26,33.66 | X1.A12 72.06,1.27 87.3,1.27 v87.3,27.3
A13  (via drill 0.33)
  Top 0.152: IC1.3 103.17,38.73 108.89,38.73 109.52,38.1 110.8,38.1 112.07,36.83 112.07,34.29 RN4.4 108.26,32.38 101.9,32.38 97.46,27.94 75.23,27.94 v73.33,26.03 | X1.A13 66.98,6.35 66.98,13.97 v71.42,13.97
  Bottom 0.152: v71.42,13.97 73.33,15.88 v73.33,26.03
A14  (via drill 0.33)
  Top 0.152: IC1.4 100.64,40 100.64,38.1 108.89,38.1 RN4.5 | v66.98,1.27 67.61,0.63 110.16,0.63 112.7,3.17 112.7,13.33 v112.07,13.33
  Bottom 0.152: v66.98,1.27 X1.A14 | v112.07,13.33 112.07,34.92 RN4.5
A15  (via drill 0.33)
  Top 0.152: IC1.5 103.17,43.81 108.89,43.81 109.52,43.18 110.8,43.18 112.07,41.91 112.07,39.37 | RN4.6 112.07,39.37 | X1.A15 61.9,6.35 61.9,12.06 v63.8,12.06 | v63.8,21.59 64.44,22.23 93.65,22.23 99.36,27.94 110.8,27.94 112.7,29.84 112.7,39.37 112.07,39.37
  Bottom 0.152: v63.8,21.59 v63.8,12.06
A16  (via drill 0.33)
  Top 0.152: IC1.6 100.64,45.09 100.64,43.18 108.89,43.18 RN4.7 | X1.A16 59.36,3.81 84.12,3.81 84.76,4.45 84.76,6.35 86.67,6.35 87.3,6.98 87.3,12.06 v100,12.06
  Bottom 0.152: v100,12.06 104.45,16.51 104.45,45.09 IC1.6
A17
  Top 0.152: IC1.7 107.62,44.45 RN4.8
  Bottom 0.152: X1.A17 60,0.63 97.46,0.63 97.46,11.43 98.73,12.7 98.73,50.16 101.9,53.34 103.17,53.34 104.45,52.07 104.45,51.44 IC1.7
A18  (via drill 0.33)
  Top 0.152: IC1.8 107.62,46.99 RN4.9 | X1.A18 55.55,2.54 v90.47,2.54 | v100,14.6 v92.38,14.6
  Bottom 0.152: v90.47,2.54 92.38,4.45 v92.38,14.6 | v100,14.6 100,49.53 IC1.8
A19
  Top 0.152: RN1.2 4.12,4.45 16.18,4.45 16.81,3.81 38.41,3.81 39.04,4.45 39.04,6.35 49.2,6.35 X1.A19
  Bottom 0.152: IC2.21 48.56,48.89 48.56,46.99 49.2,46.36 49.2,6.35 X1.A19
A20  (via drill 0.33)
  Top 0.152: v1.58,22.86 2.84,24.13 v46.66,24.13
  Bottom 0.152: RN1.3 1.58,9.52 v1.58,22.86 | X1.A20 46.66,6.35 v46.66,24.13 47.3,24.77 47.3,47.62 IC2.22
A21  (via drill 0.33)
  Top 0.152: v12.37,19.05 14.27,20.95 v42.85,20.95
  Bottom 0.152: v12.37,19.05 RN1.4 | 43.48,20.32 44.12,19.69 44.12,6.98 45.39,5.71 X1.A21 | 43.48,20.32 v42.85,20.95 | IC2.23 43.48,45.09 43.48,20.32
A22  (via drill 0.33)
  Top 0.152: RN1.5 7.29,8.89 v18.09,8.89 | v18.72,2.54 40.31,2.54 X1.A22 | IC2.24 44.75,43.81 v40.94,43.81 | v21.26,18.41 v40.94,18.41
  Bottom 0.152: 18.72,8.25 v18.09,8.89 | v18.72,2.54 18.72,8.25 | v40.94,18.41 v40.94,43.81 | v21.26,18.41 18.72,15.88 18.72,8.25
A23  (via drill 0.33)
  Top 0.152: X1.A23 38.41,3.17 18.09,3.17 15.55,0.63 0.94,0.63 0.94,12.7 RN1.6 1.58,15.24 1.58,17.78 2.84,19.05 4.12,19.05 6.66,21.59 v42.22,21.59 | IC2.25 44.75,41.27 v42.85,41.27
  Bottom 0.152: v42.85,41.27 42.22,40.64 v42.22,21.59
A24  (via drill 0.33)
  Top 0.152: RN1.7 35.23,17.78 36.5,16.51 | v38.41,14.6 36.5,16.51 | IC2.26 46.03,38.73 v48.56,38.73 | v48.56,18.41 46.66,16.51 36.5,16.51
  Bottom 0.152: v38.41,14.6 39.04,13.97 39.04,6.35 X1.A24 | v48.56,18.41 v48.56,38.73
A25  (via drill 0.33)
  Top 0.152: RN1.8 5.38,22.23 v33.96,22.23 v42.85,22.23 | IC2.27 44.75,36.2 v42.85,36.2
  Bottom 0.152: v33.96,22.23 33.96,6.98 35.23,5.71 X1.A25 | v42.85,22.23 v42.85,36.2
A26  (via drill 0.33)
  Top 0.152: RN1.9 v31.42,22.86 v44.12,22.86
  Bottom 0.152: v31.42,22.86 31.42,6.35 X1.A26 | IC2.28 44.12,33.02 v44.12,22.86
A27  (via drill 0.33)
  Top 0.152: v52.38,29.21 v36.5,29.21 RN2.2
  Bottom 0.152: v52.38,29.21 53.01,29.84 IC2.1 | X1.A27 32.05,3.17 36.5,3.17 v36.5,29.21
A28  (via drill 0.33)
  Top 0.152: v13.01,17.14 18.72,11.43 23.16,11.43 23.8,10.79 23.8,6.35 26.34,6.35 X1.A28 | v51.11,28.57 4.75,28.57 4.12,27.94 2.84,27.94 1.58,29.21 1.58,31.75 RN2.3
  Bottom 0.152: RN2.3 13.01,22.23 v13.01,17.14 | IC2.2 51.11,34.92 v51.11,28.57
A29  (via drill 0.33)
  Top 0.152: v54.92,29.84 7.92,29.84 RN2.4
  Bottom 0.152: RN2.4 13.64,24.13 13.64,6.35 17.45,2.54 17.45,1.9 18.09,1.27 25.07,1.27 X1.A29 | IC2.3 54.92,37.46 v54.92,29.84
A30  (via drill 0.33)
  Top 0.152: RN2.5 9.83,30.48 v16.18,30.48 v56.82,30.48
  Bottom 0.152: v16.18,30.48 21.89,24.77 21.89,11.43 21.26,10.79 21.26,6.35 X1.A30 | IC2.4 56.82,41.91 v56.82,30.48
ARD-RXIN
  Bottom 0.152: IC10.2 13.64,80.01 13.64,90.8 12.37,92.08 12.37,121.28 13.64,122.56 13.64,167.64 8.56,172.72 8.56,175.9 9.83,177.16 89.84,177.16 JP1.P$3
ARD-TXOUT  (via drill 0.33)
  Top 0.152: v23.8,154.31 40.94,171.45 89.84,171.45 JP1.P$2
  Bottom 0.152: IC10.3 23.8,85.09 v23.8,154.31
B3  (via drill 0.33)
  Top 0.152: RN2.6 10.46,32.38 v50.47,32.38 | v89.84,16.51 87.94,18.41 v50.47,18.41
  Bottom 0.152: IC2.5 53.01,43.81 50.47,41.27 v50.47,32.38 v50.47,18.41 | X1.B3 89.84,8.89 v89.84,16.51
B4  (via drill 0.33)
  Top 0.152: RN2.7 4.75,43.18 25.7,43.18 28.25,45.72 47.3,45.72 48.56,46.99 IC2.6 | v89.84,3.17 58.09,3.17 56.82,4.45 56.82,12.06 v57.45,12.06
  Bottom 0.152: X1.B4 89.84,6.35 v89.84,3.17 | v57.45,12.06 58.72,13.33 58.72,51.44 56.82,53.34 51.11,53.34 51.11,49.53 53.01,47.62 IC2.6
B5  (via drill 0.33)
  Top 0.152: RN2.8 1.58,46.36 1.58,53.34 53.64,53.34 54.92,52.07 | 54.92,52.07 54.92,49.53 IC2.7 | X1.B5 84.76,8.89 84.76,13.33 v91.75,13.33 | v91.75,53.97 89.84,55.88 58.72,55.88 54.92,52.07
  Bottom 0.152: v91.75,53.97 v91.75,13.33
B6  (via drill 0.33)
  Top 0.152: RN2.9 7.29,50.8 51.74,50.8 IC2.8 | X1.B6 82.22,6.35 80.31,6.35 79.68,6.98 79.68,11.43 v79.05,11.43 | v58.09,20.95 v79.05,20.95
  Bottom 0.152: v79.05,20.95 v79.05,11.43 | v58.09,20.95 58.09,51.44 57.45,52.07 IC2.8
B7  (via drill 0.33)
  Top 0.152: v81.58,11.43 82.22,10.79 82.22,7.62 X1.B7
  Bottom 0.152: IC3.21 81.58,48.89 v81.58,11.43
B8
  Bottom 0.152: IC3.22 76.5,47.62 76.5,11.43 77.14,10.79 77.14,8.89 X1.B8
B9
  Top 0.152: IC3.23 79.68,45.72 96.83,45.72 101.9,50.8 103.17,50.8 108.26,45.72 110.8,45.72 113.33,43.18 113.33,13.97 80.31,13.97 77.14,10.79 77.14,7.62 X1.B9
B10  (via drill 0.33)
  Top 0.152: v75.23,11.43 74.6,10.79 74.6,7.62 X1.B10
  Bottom 0.152: IC3.24 80.31,46.36 80.31,49.53 79.05,50.8 75.87,50.8 75.87,26.03 75.23,25.4 v75.23,11.43
B11  (via drill 0.33)
  Top 0.152: v75.23,38.73 IC3.25
  Bottom 0.152: v75.23,38.73 73.97,37.46 73.97,12.7 72.06,10.79 72.06,9.52 70.79,8.25 X1.B11
B12  (via drill 0.33)
  Top 0.152: v80.31,27.3 78.41,25.4 v72.06,25.4
  Bottom 0.152: IC3.26 80.31,37.46 v80.31,27.3 | v72.06,25.4 69.52,22.86 69.52,8.89 X1.B12
B13  (via drill 0.33)
  Top 0.152: IC3.27 77.14,38.1 v64.44,38.1
  Bottom 0.152: v64.44,38.1 64.44,8.89 X1.B13
B14  (via drill 0.33)
  Top 0.152: IC3.28 75.23,31.12 v63.17,31.12
  Bottom 0.152: v63.17,31.12 62.53,30.48 62.53,11.43 61.9,10.79 61.9,8.89 X1.B14
B15  (via drill 0.33)
  Top 0.152: IC3.1 81.58,29.84 v60,29.84
  Bottom 0.152: v60,29.84 59.36,29.21 59.36,8.89 X1.B15
B16  (via drill 0.33)
  Top 0.152: IC3.2 79.68,30.48 v61.9,30.48 | v61.27,12.06 60.63,11.43 60,11.43 59.36,10.79 59.36,7.62 X1.B16
  Bottom 0.152: v61.9,30.48 61.27,29.84 v61.27,12.06
B17  (via drill 0.33)
  Top 0.152: v83.49,30.48 82.22,29.21 v54.28,29.21
  Bottom 0.152: IC3.3 83.49,36.83 v83.49,30.48 | v54.28,29.21 54.28,8.89 X1.B17
B18  (via drill 0.33)
  Top 0.152: v87.94,26.03 84.76,22.86 v52.38,22.86
  Bottom 0.152: IC3.4 87.94,40 v87.94,26.03 | v52.38,22.86 51.74,22.23 51.74,8.89 X1.B18
B19  (via drill 0.33)
  Top 0.152: IC3.5 89.2,41.27 89.2,28.57 73.97,28.57 71.42,26.03 v53.01,26.03 | v53.01,12.06 51.74,10.79 51.74,7.62 X1.B19
  Bottom 0.152: v53.01,12.06 v53.01,26.03
B20  (via drill 0.33)
  Top 0.152: IC3.6 87.94,48.89 87.94,53.34 58.72,53.34 55.55,50.16 55.55,48.26 v51.11,48.26 | v49.83,11.43 49.2,10.79 49.2,7.62 X1.B20
  Bottom 0.152: v51.11,48.26 51.11,42.55 49.83,41.27 v49.83,11.43
B21  (via drill 0.33)
  Top 0.152: IC3.7 84.76,48.26 56.19,48.26 53.64,45.72 v48.56,45.72 | v47.3,11.43 46.66,10.79 46.66,7.62 X1.B21
  Bottom 0.152: v48.56,45.72 47.93,45.09 47.93,12.06 v47.3,11.43
B22  (via drill 0.33)
  Top 0.152: IC3.8 84.76,50.8 v63.8,50.8 | v59.36,33.66 57.45,31.75 v45.39,31.75 | v44.75,11.43 44.12,10.79 44.12,7.62 X1.B22
  Bottom 0.152: v63.8,50.8 59.36,50.8 v59.36,33.66 | v45.39,31.75 44.75,31.12 v44.75,11.43
B23  (via drill 0.33)
  Top 0.152: v33.33,12.7 37.14,12.7 39.04,10.79 39.04,7.62 X1.B23
  Bottom 0.152: IC4.21 33.33,47.62 v33.33,12.7
B24  (via drill 0.33)
  Top 0.152: v32.69,12.06 35.23,12.06 36.5,10.79 36.5,7.62 X1.B24
  Bottom 0.152: IC4.22 32.69,45.72 v32.69,12.06
B25  (via drill 0.33)
  Top 0.152: v32.05,11.43 33.33,11.43 33.96,10.79 33.96,7.62 X1.B25
  Bottom 0.152: IC4.23 32.05,43.81 v32.05,11.43
B26
  Bottom 0.152: IC4.24 30.78,42.55 30.78,12.7 28.88,10.79 28.88,6.98 29.52,6.35 30.78,6.35 31.42,5.71 31.42,4.45 32.05,3.81 33.96,3.81 33.96,6.35 X1.B26
B27  (via drill 0.33)
  Top 0.152: IC4.25 28.25,41.27 v25.7,41.27 | v25.7,12.7 26.98,11.43 28.25,11.43 28.88,10.79 28.88,7.62 X1.B27
  Bottom 0.152: v25.7,12.7 v25.7,41.27
B28  (via drill 0.33)
  Top 0.152: IC4.26 26.34,36.83 v25.07,36.83 | v25.07,13.33 25.07,11.43 25.7,11.43 26.34,10.79 26.34,7.62 X1.B28
  Bottom 0.152: v25.07,13.33 v25.07,36.83
B29  (via drill 0.33)
  Top 0.152: IC4.27 28.25,36.2 v24.44,36.2
  Bottom 0.152: v24.44,36.2 24.44,12.7 26.34,10.79 26.34,8.89 X1.B29
B30
  Bottom 0.152: IC4.28 26.98,36.2 26.98,45.09 25.7,46.36 24.44,46.36 24.44,37.46 23.8,36.83 23.8,9.52 22.53,8.25 X1.B30
BIT0  (via drill 0.33)
  Top 0.152: IC9.18 69.52,96.52 57.45,96.52 56.19,97.79 v39.67,97.79
  Bottom 0.152: IC6.1 23.8,38.1 23.8,53.97 28.25,58.42 34.59,58.42 34.59,69.85 36.5,71.75 36.5,92.71 IC8.3 39.04,97.16 v39.67,97.79
BIT1  (via drill 0.33)
  Top 0.152: IC6.2 23.8,40.64 v40.31,40.64 | IC9.16 79.05,104.78 60.63,104.78 54.28,98.42 v42.22,98.42
  Bottom 0.152: v40.31,40.64 40.31,76.83 41.58,78.11 IC8.4 41.58,97.79 v42.22,98.42
BIT2  (via drill 0.33)
  Top 0.152: v23.16,72.39 26.34,75.56 v44.12,75.56 | IC9.14 86.03,97.16 84.76,95.89 84.76,92.71 v48.56,92.71
  Bottom 0.152: IC6.3 23.16,42.55 v23.16,72.39 | v44.12,75.56 48.56,80.01 v48.56,92.71 48.56,94.61 IC8.7
BIT3  (via drill 0.33)
  Top 0.152: IC6.4 20.62,42.55 27.61,42.55 28.25,43.18 v49.83,43.18 | IC9.12 85.39,108.58 v54.92,108.58
  Bottom 0.152: v49.83,43.18 50.47,43.81 50.47,69.22 52.38,71.12 52.38,94.61 IC8.8 51.74,100.97 50.47,102.23 50.47,104.14 v54.92,108.58
BIT4  (via drill 0.33)
  Top 0.152: v26.34,79.38 30.78,83.82 v54.28,83.82 73.97,83.82 81.58,91.44 87.3,91.44 IC9.9
  Bottom 0.152: IC6.5 22.53,46.99 22.53,74.3 26.34,78.11 v26.34,79.38 | IC8.13 53.01,101.6 53.01,85.09 v54.28,83.82
BIT5  (via drill 0.33)
  Top 0.152: IC6.6 21.26,48.26 v49.2,48.26 | IC9.7 86.03,92.08 v49.2,92.08
  Bottom 0.152: v49.2,48.26 v49.2,92.08 49.2,93.34 50.47,94.61 50.47,101.6 IC8.14
BIT6  (via drill 0.33)
  Top 0.152: IC6.7 20.62,50.16 v25.07,50.16 | v39.04,91.44 v78.41,91.44
  Bottom 0.152: v25.07,50.16 28.25,53.34 39.04,53.34 v39.04,91.44 39.04,93.34 40.31,94.61 40.31,101.6 IC8.17 | IC9.5 78.41,92.71 v78.41,91.44
BIT7  (via drill 0.33)
  Top 0.152: 26.34,93.34 33.96,100.97 37.14,100.97 IC8.18 | 26.34,93.34 v25.7,92.71 | IC9.3 73.97,93.34 26.34,93.34
  Bottom 0.152: IC6.8 21.89,53.97 21.89,76.2 23.8,78.11 23.8,83.19 26.34,85.72 26.34,92.08 v25.7,92.71
C3  (via drill 0.33)
  Top 0.152: IC4.1 37.77,33.02 v45.39,33.02 | v46.03,22.86 48.56,20.32 v89.2,20.32
  Bottom 0.152: v45.39,33.02 46.03,32.38 v46.03,22.86 | v89.2,20.32 91.11,18.41 X1.C3
C4  (via drill 0.33)
  Top 0.152: IC4.2 37.77,35.56 82.86,35.56 85.39,38.1 v88.57,38.1
  Bottom 0.152: X1.C4 v88.57,38.1
C5  (via drill 0.33)
  Top 0.152: v37.77,19.69 38.41,19.05 v84.12,19.05
  Bottom 0.152: IC4.3 38.41,37.46 38.41,27.94 37.77,27.3 v37.77,19.69 | v84.12,19.05 86.03,17.14 X1.C5
C6  (via drill 0.33)
  Top 0.152: v38.41,20.32 39.04,19.69 v83.49,19.69
  Bottom 0.152: IC4.4 39.04,39.37 39.04,27.94 38.41,27.3 v38.41,20.32 | X1.C6 v83.49,19.69
C7  (via drill 0.33)
  Top 0.152: v79.05,23.49 v39.04,23.49
  Bottom 0.152: IC4.5 39.67,41.27 39.67,27.94 39.04,27.3 v39.04,23.49 | v79.05,23.49 80.95,21.59 X1.C7
C8  (via drill 0.33)
  Top 0.152: v33.96,27.3 36.5,24.77 70.79,24.77 71.42,24.13 v77.78,24.13
  Bottom 0.152: IC4.6 38.41,48.89 38.41,49.53 37.14,50.8 33.96,50.8 v33.96,27.3 | v77.78,24.13 78.41,23.49 X1.C8
C9  (via drill 0.33)
  Top 0.152: v34.59,27.94 37.14,25.4 70.79,25.4 71.42,24.77 v75.87,24.77
  Bottom 0.152: IC4.7 34.59,47.62 v34.59,27.94 | X1.C9 v75.87,24.77
C10  (via drill 0.33)
  Top 0.152: IC4.8 37.14,51.44 v40.94,51.44
  Bottom 0.152: v40.94,51.44 41.58,50.8 41.58,6.98 42.22,6.35 44.12,6.35 44.12,4.45 44.75,3.81 54.28,3.81 54.28,5.71 54.92,6.35 72.06,6.35 72.06,8.89 X1.C10
C11  (via drill 0.33)
  Top 0.152: v67.61,52.07 IC5.21
  Bottom 0.152: v67.61,52.07 68.89,53.34 72.69,53.34 72.69,16.51 70.79,14.6 X1.C11
C12
  Bottom 0.152: IC5.22 66.34,45.09 66.34,37.46 66.98,36.83 66.98,11.43 X1.C12
C13
  Bottom 0.152: IC5.23 65.08,43.81 65.08,37.46 65.71,36.83 X1.C13
C14
  Bottom 0.152: IC5.24 63.8,42.55 63.8,22.86 63.17,22.23 X1.C14
C15
  Bottom 0.152: IC5.25 60,40 60,31.12 60.63,30.48 X1.C15
C16  (via drill 0.33)
  Top 0.152: IC5.26 61.27,38.73 v56.19,38.73
  Bottom 0.152: v56.19,38.73 56.19,12.06 X1.C16
C17  (via drill 0.33)
  Top 0.152: IC5.27 61.27,36.2 v55.55,36.2
  Bottom 0.152: X1.C17 v55.55,36.2
C18  (via drill 0.33)
  Top 0.152: IC5.28 56.19,34.29 v54.28,32.38
  Bottom 0.152: v54.28,32.38 53.64,31.75 53.64,10.79 X1.C18
C19  (via drill 0.33)
  Top 0.152: IC5.1 66.98,31.75 58.09,31.75 57.45,31.12 v52.38,31.12
  Bottom 0.152: v52.38,31.12 51.74,30.48 51.74,22.86 51.11,22.23 51.11,10.79 X1.C19
C20  (via drill 0.33)
  Top 0.152: IC5.2 68.89,36.2 v65.08,36.2 | v65.08,13.97 64.44,13.33 45.39,13.33 45.39,12.06 47.93,12.06 X1.C20
  Bottom 0.152: v65.08,13.97 v65.08,36.2
C21  (via drill 0.33)
  Top 0.152: IC5.3 68.89,38.73 v65.71,38.73 | v66.34,13.97 65.08,12.7 v46.03,12.7
  Bottom 0.152: v65.71,38.73 65.71,37.46 66.34,36.83 v66.34,13.97 | v46.03,12.7 45.39,12.06 X1.C21
C22  (via drill 0.33)
  Top 0.152: v67.61,17.78 65.08,15.24 46.66,15.24 42.85,11.43 X1.C22
  Bottom 0.152: IC5.4 67.61,40 v67.61,17.78
C23  (via drill 0.33)
  Top 0.152: IC5.5 68.25,43.18 51.11,43.18 48.56,40.64 42.22,40.64 v40.31,38.73
  Bottom 0.152: X1.C23 v40.31,38.73
C24  (via drill 0.33)
  Top 0.152: v72.06,27.94 70.79,26.67 v39.67,26.67
  Bottom 0.152: IC5.6 67.61,48.89 67.61,49.53 68.89,50.8 72.06,50.8 v72.06,27.94 | v39.67,26.67 39.67,17.14 37.77,15.24 X1.C24
C25  (via drill 0.33)
  Top 0.152: v71.42,28.57 70.79,27.94 v35.86,27.94
  Bottom 0.152: IC5.7 71.42,47.62 v71.42,28.57 | v35.86,27.94 35.23,27.3 X1.C25
C26  (via drill 0.33)
  Top 0.152: IC5.8 68.89,51.44 63.17,51.44 62.53,50.8 v57.45,50.8 | v57.45,17.78 55.55,15.88 40.94,15.88 38.41,13.33 32.69,13.33 31.42,12.06 31.42,10.16 X1.C26
  Bottom 0.152: v57.45,17.78 v57.45,50.8
C27  (via drill 0.33)
  Top 0.152: v14.91,17.14 18.09,13.97 27.61,13.97 30.15,11.43 X1.C27
  Bottom 0.152: IC6.21 14.91,49.53 v14.91,17.14
C28  (via drill 0.33)
  Top 0.152: IC6.22 16.18,45.72 v25.07,45.72
  Bottom 0.152: v25.07,45.72 26.34,44.45 26.34,11.43 X1.C28
C29
  Bottom 0.152: IC6.23 14.27,45.09 14.27,6.35 18.09,2.54 18.09,1.9 23.8,1.9 23.8,8.89 X1.C29
C30  (via drill 0.33)
  Top 0.152: IC6.24 13.01,43.81 v16.18,43.81
  Bottom 0.152: v16.18,43.81 18.09,41.91 18.09,31.75 22.53,27.3 X1.C30
GND
  Top 0.152: 11.73,128.91 17.45,128.91 S6.3 17.45,129.54 28.88,129.54 | 11.73,128.91 6.02,128.91 S7.3 | 28.88,129.54 40.31,129.54 | 28.88,129.54 S5.3 | 40.31,129.54 51.74,129.54 | 40.31,129.54 S4.3 | 51.74,129.54 63.17,129.54 | 51.74,129.54 S3.3 | 63.17,129.54 74.6,129.54 | 63.17,129.54 S2.3 | 74.6,129.54 86.03,129.54 | 74.6,129.54 S1.3 | 86.03,129.54 105.08,129.54 IN.3 | 86.03,129.54 S0.3 | 17.45,154.31 11.73,154.31 | 11.73,154.31 6.02,154.31 R24.2 | 21.26,154.31 21.26,164.47 | 21.26,164.47 S-A.3 | 17.45,154.31 21.26,154.31 | 17.45,154.31 R23.2 | S-B.3 29.52,164.47 21.26,164.47 | 21.26,164.47 16.18,164.47 5.38,175.26 BUS-RESET.2 | 40.31,154.31 28.88,154.31 R22.2 28.88,153.67 21.89,153.67 21.26,154.31 | 40.31,154.31 R9.2 R11.2 48.56,157.48 51.74,154.31 | 40.31,154.31 R21.2 | R14.2 R19.2 | 51.74,154.31 52.38,154.31 R13.2 R14.2 | 51.74,154.31 R20.2 | JP1.P$5 JP1.P$6 | 74.6,154.31 71.42,157.48 R15.2 R14.2 | 74.6,154.31 86.03,154.31 | 74.6,154.31 R18.2 | 86.03,154.31 105.08,154.31 R16.2 | 86.03,154.31 R17.2 | 11.73,154.31 11.73,128.91 | IC7.4 87.3,80.01 JP2.1 98.1,84.45 98.73,84.45 CPU-RESET.1 | X1.B1 X1.C1 | IC1.10 97.46,62.23 IC1.17 | IC8.1 35.86,97.16 54.92,97.16 IC8.10 | 51.74,58.42 47.93,62.23 IC2.17 44.12,60.96 26.98,60.96 | 51.74,58.42 IC2.10 | 68.25,58.42 IC5.10 | 51.74,58.42 68.25,58.42 | IC6.10 18.72,58.42 | 18.72,58.42 IC6.16 | IC4.10 35.86,57.78 30.15,57.78 29.52,58.42 26.98,58.42 | 18.72,58.42 26.98,58.42 | C4.1 12.37,91.44 16.18,91.44 C9.1 21.89,88.27 25.7,88.27 IC10.22 | C2.1 16.18,72.39 21.89,72.39 23.16,71.12 C3.1 | 26.98,60.96 26.98,62.23 IC4.17 | 26.98,60.96 26.98,58.42 | C5.1 63.17,72.39 49.2,72.39 C11.1 | IC3.10 84.76,58.42 68.25,58.42
  Bottom 0.152: PWR.K 111.43,171.45 111.43,160.66 105.08,154.31 R16.2 | JP1.P$5 86.03,172.72 R17.2 | 79.68,63.5 80.95,64.77 80.95,67.31 | 79.68,63.5 IC3.17 | C8.1 80.95,69.85 | 80.95,69.85 80.95,67.31 | 79.68,63.5 IC3.10 | 80.95,67.31 IC3.15 | 94.92,95.25 98.73,95.25 98.73,85.09 CPU-RESET.1 | 94.92,95.25 IC9.10 | 80.95,69.85 86.03,69.85 IC7.4 | X1.B1 X1.A1 | IC1.17 IC1.16 IC1.15 94.92,68.58 C1.1 97.46,76.2 JP2.1 | X1.C1 96.83,10.79 96.83,48.89 100.64,52.7 100.64,55.25 IC1.10 | IC5.16 IC5.15 61.9,68.58 C5.1 59.36,76.2 C6.1 59.36,84.45 C7.1 60,85.09 60,95.25 | C13.1 60,95.89 60,95.25 | 60,95.25 IC8.10 | IC2.17 IC2.16 47.3,66.67 47.3,70.48 C11.1 | X1.A32 X1.B32 X1.C32 15.55,12.06 15.55,70.48 C2.1 | IC4.17 31.42,64.77 C3.1 31.42,77.47 IC10.8 30.15,83.82 28.88,85.09 | 28.88,85.09 IC10.22 | C12.1 28.88,99.06 28.88,85.09 | 94.92,95.25 94.92,120.01 86.03,128.91 S0.3
IN-SWITCH  (via drill 0.33)
  Top 0.152: v6.66,67.31 15.55,76.2 93.02,76.2 108.89,92.08 108.89,124.46 IN.2
  Bottom 0.152: IC6.26 6.66,45.09 v6.66,67.31
LEDS-LD  (via drill 0.33)
  Top 0.152: v6.02,105.41 54.28,105.41 IC8.11
  Bottom 0.152: IC6.27 6.02,43.18 v6.02,105.41
N$1
  Bottom 0.152: IC10.19 35.23,170.18 LED1.A
N$2
  Top 0.152: IC7.7 82.86,88.27 87.94,88.27 JP2.2
N$3
  Top 0.152: IC10.9 34.59,80.64 51.11,80.64 Q1.2 51.74,80.01 56.82,80.01 C6.2
N$4
  Top 0.152: IC10.10 33.33,76.83 25.07,76.83 23.8,78.11 23.8,84.45 51.11,84.45 Q1.1 51.74,85.09 56.82,85.09 C7.2
N$5  (1 unrouted)
  Bottom 0.152: 108.89,167.64 108.89,173.99 PWR.A
N$6  (via drill 0.33)
  Top 0.152: IC10.18 37.77,92.71 v32.05,92.71
  Bottom 0.152: v32.05,92.71 32.05,114.3 34.59,116.84 34.59,170.81 40.31,176.53 47.93,176.53 LED2.A
N$7  (via drill 0.33)
  Top 0.152: v40.94,88.9 42.22,90.17 v53.64,90.17
  Bottom 0.152: IC10.17 40.94,87 v40.94,88.9 | v53.64,90.17 55.55,92.08 55.55,95.89 59.36,99.69 59.36,132.72 65.08,138.43 65.08,164.47 55.55,173.99 LED3.A
N$8  (via drill 0.33)
  Top 0.152: IC10.16 40.94,88.27 40.31,88.27 40.31,90.8 v63.8,90.8
  Bottom 0.152: v63.8,90.8 66.98,93.98 66.98,171.45 LED4.A
N$9
  Top 0.152: C10.1 DTR-RESET.2
N$10  (via drill 0.33)
  Top 0.152: IC10.15 47.93,88.9 v67.61,88.9
  Bottom 0.152: v67.61,88.9 69.52,90.8 69.52,173.99 LED5.A
N$11
  Bottom 0.152: LED2.K R11.1
N$12
  Bottom 0.152: LED1.K R9.1
N$13
  Bottom 0.152: LED3.K R13.1
N$14
  Top 0.152: IC10.21 23.8,92.71 C9.2
N$15
  Bottom 0.152: LED4.K R14.1
N$16
  Bottom 0.152: LED5.K R15.1
N$17
  Top 0.152: R24.1 L7.K
N$18
  Bottom 0.152: IC10.23 24.44,87 24.44,160.66 S-A.2
N$19
  Bottom 0.152: IC10.24 21.26,87.63 21.26,161.93 17.45,165.73 17.45,167 18.72,168.28 28.88,168.28 S-B.2
N$20
  Top 0.152: R23.1 L6.K
N$21
  Top 0.152: R22.1 L5.K
N$22
  Top 0.152: R21.1 L4.K
N$23
  Top 0.152: R20.1 L3.K
N$24
  Top 0.152: R19.1 L2.K
N$25
  Top 0.152: R18.1 L1.K
N$26
  Top 0.152: R17.1 L0.K
N$27
  Top 0.152: R16.1 OUT.K
N$28
  Top 0.152: JP1.P$1 DTR-RESET.1
N$29
  Bottom 0.152: FTDI-VCC.2 87.3,163.83 JP1.P$4
N$31  (via drill 0.33)
  Top 0.152: v45.39,137.16 73.33,137.16 L1.A
  Bottom 0.152: IC8.5 45.39,96.52 v45.39,137.16
N$32
  Bottom 0.152: IC8.9 55.55,96.52 55.55,129.54 64.44,138.43 63.17,139.7 51.74,139.7 L3.A
N$33  (via drill 0.33)
  Top 0.152: IC8.12 52.38,104.78 v44.75,104.78
  Bottom 0.152: v44.75,104.78 44.12,105.41 44.12,134.62 L4.A
N$34  (via drill 0.33)
  Top 0.152: v46.03,137.79 44.12,139.7 30.15,139.7 L5.A
  Bottom 0.152: IC8.15 46.03,103.5 v46.03,137.79
N$35
  Bottom 0.152: IC8.6 47.93,96.52 47.93,111.76 54.92,118.75 54.92,130.18 L2.A
N$36  (via drill 0.33)
  Top 0.152: v36.5,137.16 18.09,137.16 17.45,137.79 L6.A
  Bottom 0.152: IC8.16 43.48,103.5 43.48,130.18 v36.5,137.16
N$37
  Top 0.152: IC8.19 34.59,104.78 6.66,104.78 6.02,104.14 4.75,104.14 2.84,106.05 2.84,137.79 6.02,137.79 L7.A
N$38  (via drill 0.33)
  Top 0.152: v35.86,136.53 84.12,136.53 L0.A
  Bottom 0.152: IC8.2 37.77,96.52 37.77,116.84 35.86,118.75 v35.86,136.53
N$39
  Bottom 0.152: IC10.25 18.72,87.63 18.72,97.79 R25.1 14.27,104.78 14.27,175.26 BUS-RESET.1
N$40
  Bottom 0.152: IC9.2 78.41,90.17 89.84,90.17 89.84,120.65 S0.2
N$41  (via drill 0.33)
  Top 0.152: v80.95,121.92 76.5,126.37 53.64,126.37 S3.2
  Bottom 0.152: IC9.8 84.76,99.06 84.76,116.84 80.95,120.65 v80.95,121.92
N$42  (via drill 0.33)
  Top 0.152: IC9.6 81.58,97.16 70.79,97.16 69.52,95.89 v58.72,95.89
  Bottom 0.152: v58.72,95.89 60,97.16 60,121.28 S2.2
N$43
  Bottom 0.152: IC9.4 79.68,96.52 79.68,120.01 75.23,124.46 S1.2
N$44  (via drill 0.33)
  Top 0.152: IC9.11 78.41,118.11 v37.77,118.11
  Bottom 0.152: v37.77,118.11 37.14,118.75 37.14,121.28 S4.2
N$45  (via drill 0.33)
  Top 0.152: v77.78,120.65 76.5,121.92 8.56,121.92 S7.2
  Bottom 0.152: IC9.17 77.78,103.5 v77.78,120.65
N$46  (via drill 0.33)
  Top 0.152: IC9.13 83.49,107.95 43.48,107.95 v33.96,117.47
  Bottom 0.152: v33.96,117.47 32.05,119.38 32.05,121.28 S5.2
N$47  (via drill 0.33)
  Top 0.152: v80.31,120.65 78.41,122.56 19.35,122.56 S6.2
  Bottom 0.152: IC9.15 80.31,106.05 v80.31,120.65
OUT-LED  (via drill 0.33)
  Top 0.152: v13.01,129.54 19.35,135.89 103.17,135.89 105.08,137.79 OUT.A
  Bottom 0.152: IC6.25 7.29,46.99 7.29,116.84 13.01,122.56 v13.01,129.54
SCL
  Top 0.152: 35.23,63.5 21.26,63.5 IC6.12 16.18,66.04 6.02,66.04 6.02,74.3 12.37,80.64 IC10.28 | IC4.12 35.23,63.5 | 51.74,63.5 IC2.12 | 35.23,63.5 51.74,63.5 | 68.25,63.5 IC5.12 | 51.74,63.5 68.25,63.5 | 84.76,63.5 IC3.12 | 68.25,63.5 84.76,63.5 | IC1.12 101.27,63.5 84.76,63.5
  Bottom 0.152: R10.1 77.14,88.9 83.49,88.9 IC7.6 87.94,81.91 87.94,64.14 IC3.12
SDA
  Top 0.152: 84.76,66.04 IC3.13 | 84.76,66.04 70.79,66.04 IC5.13 68.25,66.04 51.74,66.04 | IC7.5 80.31,80.64 73.97,80.64 R12.1 | IC1.13 101.27,66.04 84.76,66.04 | IC6.13 21.26,66.04 35.23,66.04 | IC4.13 35.23,66.04 | 51.74,66.04 IC2.13 | 35.23,66.04 51.74,66.04
  Bottom 0.152: IC5.13 73.33,68.58 R12.1 | IC10.27 16.18,85.09 16.18,74.3 18.72,71.75 18.72,67.94 18.09,67.31 18.09,66.67 IC6.13
SWITCHES-RD  (via drill 0.33)
  Top 0.152: IC6.28 13.64,35.56 33.33,35.56 35.86,38.1 62.53,38.1 v66.98,42.55
  Bottom 0.152: v66.98,42.55 66.98,69.22 70.79,73.03 IC9.1 70.79,100.33 IC9.19
VCC  (2 unrouted)
  Top 0.152: FTDI-VCC.1 107.62,158.75 | S-A.1 18.09,168.28 24.44,168.28 S-B.1 | 17.45,120.01 6.02,120.01 S7.1 | 17.45,120.01 28.88,120.01 | 17.45,120.01 S6.1 | 28.88,120.01 40.31,120.01 | 28.88,120.01 S5.1 | 40.31,120.01 51.74,120.01 | 40.31,120.01 S4.1 | 51.74,120.01 63.17,120.01 | 51.74,120.01 S3.1 | 63.17,120.01 74.6,120.01 | 63.17,120.01 S2.1 | 74.6,120.01 86.03,120.01 | 74.6,120.01 S1.1 | 86.03,120.01 105.08,120.01 IN.1 | 86.03,120.01 S0.1 | IC9.20 65.71,97.79 C13.2 | IC7.1 IC7.2 IC7.3 | X1.B2 X1.C2 | IC1.9 101.27,53.34 88.57,53.34 87.3,54.61 IC3.9 | C1.2 97.46,68.58 92.38,68.58 | R3.2 92.38,68.58 | 84.76,69.85 86.03,68.58 92.38,68.58 | 84.76,69.85 C8.2 | 84.76,69.85 77.14,69.85 R6.2 70.79,71.12 C5.2 64.44,68.58 56.82,68.58 | IC4.9 37.77,55.88 49.83,55.88 51.11,54.61 IC2.9 | 56.82,68.58 54.28,71.12 C11.2 46.66,67.31 IC2.15 R4.2 37.77,71.12 C3.2 31.42,68.58 | 56.82,68.58 R2.2 | 19.99,6.35 X1.B31 X1.C31 | 19.99,6.35 X1.A31 | 19.99,6.35 2.84,6.35 1.58,5.08 1.58,2.54 RN1.1 | R25.2 9.83,93.98 12.37,93.98 C4.2 18.72,97.79 C12.2 28.88,97.79 IC8.20 | IC6.15 14.91,69.85 16.18,69.85 C2.2 19.99,68.58 31.42,68.58 | R7.2 IC4.15 30.15,67.31 31.42,68.58 | RN2.1 0.94,29.21 0.94,62.23 IC6.17
  Bottom 0.152: S-B.1 25.7,165.73 25.7,123.19 28.88,120.01 S5.1 | 108.26,154.31 108.26,123.19 105.08,120.01 IN.1 | IC5.9 73.97,59.05 73.97,60.33 77.78,64.14 | IC3.16 77.78,64.14 | 77.78,64.14 R6.2 | C5.2 63.17,74.93 R12.2 R10.2 63.17,96.52 C13.2 | RN3.1 108.26,4.45 108.26,24.77 RN4.1 105.08,31.75 105.08,52.07 IC1.9 | IC7.1 IC7.8 | IC7.3 C8.2 | R8.1 93.65,88.9 JP2.3 91.11,82.55 R3.2 91.11,59.69 | X1.B2 X1.A2 | 91.11,59.69 IC3.9 | X1.C2 93.02,10.79 93.02,57.78 91.11,59.69 | 60.63,63.5 58.09,66.04 R2.2 | 60.63,63.5 IC5.17 | IC2.9 57.45,59.05 57.45,60.33 60.63,63.5 | RN1.1 0.94,5.08 0.94,24.13 RN2.1 | 9.83,64.77 8.56,66.04 R5.2 | 9.83,64.77 IC6.17 | 9.83,64.77 IC6.15 | IC6.9 17.45,57.15 C2.2 | C3.2 33.96,85.09 IC10.20 32.69,101.6 IC8.20 | IC4.16 IC4.15 28.88,77.47 IC10.7 | IC9.20 70.79,115.57 74.6,119.38 S1.1

### Text on the board
tNames: WP | onepagecomputer.com | YACC1 TEST BOARD V1.1 | DATA[0..15] | ADDR[0..15]